# Altium project CaribouLite.PrjPcb (part 1 of 2)
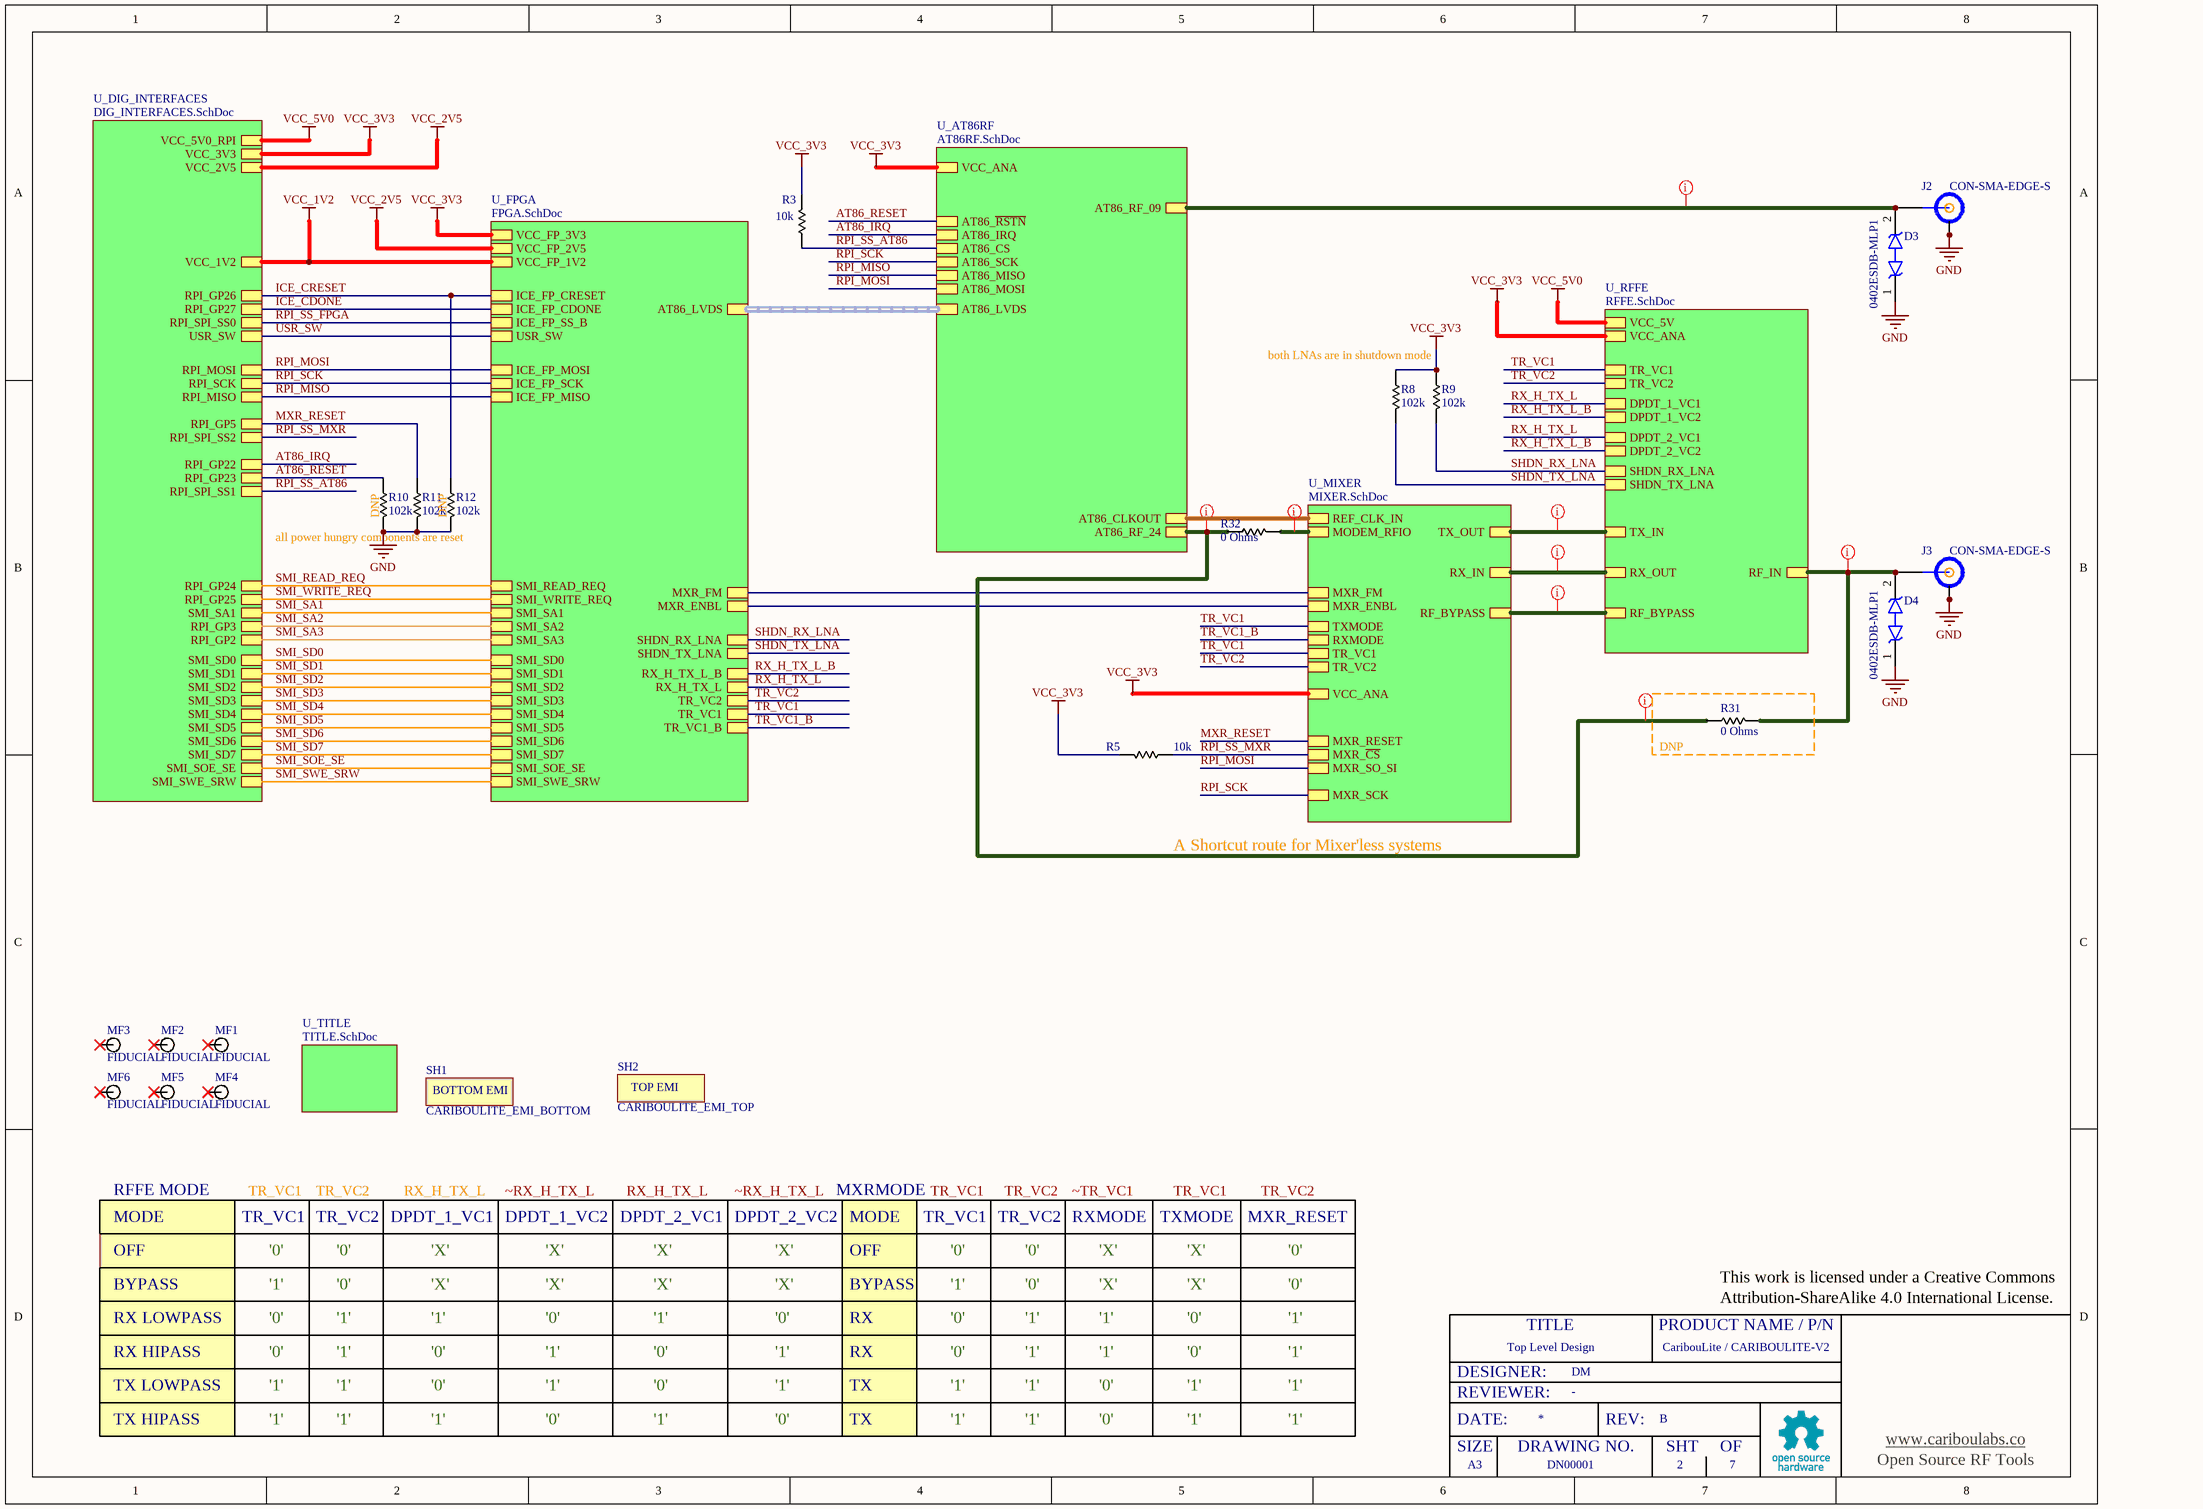
[diagram p0: Top.SchDoc]
DrawingNumber: DN00001; PCB_Designer: DM; PCB_DrawingNum: DN00002; PCB_Rev: R2.8; PCB_Reviewer: -; ProductNamePN: CaribouLite / CARIBOULITE-V2
7 sheets, 271 parts. Net scope: hierarchical (ports join the sheet entries above them; power ports are global).
Sheets:
  Top.SchDoc
    U_AT86RF = AT86RF.SchDoc
    U_FPGA = FPGA.SchDoc
    U_RFFE = RFFE.SchDoc
    U_DIG_INTERFACES = DIG_INTERFACES.SchDoc
    U_MIXER = MIXER.SchDoc
    U_TITLE = TITLE.SchDoc

## Sheet Top.SchDoc
size A3; DocumentNumber: 2; Revision: B; SheetNumber: 2; SheetTotal: 7; SheetTitle: Top Level Design; Designer: DM; Reviewer: -; PageSetup: Record=PageOptions|CenterHorizontal=True|CenterVertical=True|PrintScale=1.04|XCorrection=1.00|YCorrection=1.00|PrintKind=0|BorderSize=5000000|LeftOffset=0|BottomOffset=0|Orientation=2|PaperLength=1000|PaperWidth=1000|Scale=100|PaperSource=7|PrintQuality=-3|MediaType=1|DitherType=10|PrintScaleMode=1|PaperKind=A3 297 x 420 mm|PaperIndex=8

### Parts
D3  0402ESDB-MLP1  [DIONC1105X44N]
D4  0402ESDB-MLP1  [DIONC1105X44N]
J2  CON-SMA-EDGE-S  [MOLEX_0732511150]
J3  CON-SMA-EDGE-S  [MOLEX_0732511150]
MF1  FIDUCIAL  [FIDUCIAL_1_0_MM]  (net tie, no BOM)
MF2  FIDUCIAL  [FIDUCIAL_1_0_MM]  (net tie, no BOM)
MF3  FIDUCIAL  [FIDUCIAL_1_0_MM]  (net tie, no BOM)
MF4  FIDUCIAL  [FIDUCIAL_1_0_MM]  (net tie, no BOM)
MF5  FIDUCIAL  [FIDUCIAL_1_0_MM]  (net tie, no BOM)
MF6  FIDUCIAL  [FIDUCIAL_1_0_MM]  (net tie, no BOM)
R3  10k  [PANASONIC 0402]
R5  10k  [PANASONIC 0402]
R8  102k  [PANASONIC 0402]
R9  102k  [PANASONIC 0402]
R10  102k  [PANASONIC 0402]
R11  102k  [PANASONIC 0402]
R12  102k  [PANASONIC 0402]
R31  0 Ohms  [PANASONIC 0402]
R32  0 Ohms  [PANASONIC 0402]
SH1  CARIBOULITE_EMI_BOTTOM  [CARIBOULITE_EMI_BOTTOM]  (no BOM)
SH2  CARIBOULITE_EMI_TOP  [CARIBOULITE_EMI_TOP]  (no BOM)

### Blocks framed on the sheet
DNP: R31

### Sub-sheets
U_AT86RF = AT86RF.SchDoc: AT86_CLKOUT, AT86_RF_24, AT86_RF_09, AT86_~{RSTN}, AT86_IRQ, AT86_CS, AT86_SCK, AT86_MISO, AT86_MOSI, VCC_ANA, AT86_LVDS (harness AT86_LVDS)
U_DIG_INTERFACES = DIG_INTERFACES.SchDoc: VCC_2V5, VCC_1V2, VCC_5V0_RPI, RPI_SPI_SS2, RPI_MOSI, RPI_SCK, RPI_MISO, RPI_GP27, RPI_SPI_SS0, RPI_SPI_SS1, RPI_GP22, VCC_3V3, RPI_GP23, USR_SW, SMI_SD5, SMI_SOE_SE, SMI_SD3, SMI_SD1, SMI_SD2, SMI_SA1, SMI_SD4, SMI_SWE_SRW, SMI_SD0, SMI_SD6, SMI_SD7, RPI_GP2, RPI_GP3, RPI_GP26, RPI_GP25, RPI_GP5, RPI_GP24
U_FPGA = FPGA.SchDoc: VCC_FP_1V2, VCC_FP_3V3, AT86_LVDS (harness AT86_LVDS), ICE_FP_CRESET, ICE_FP_CDONE, ICE_FP_SS_B, ICE_FP_MOSI, ICE_FP_SCK, ICE_FP_MISO, TR_VC1, RX_H_TX_L, TR_VC2, TR_VC1_B, RX_H_TX_L_B, SHDN_TX_LNA, SHDN_RX_LNA, USR_SW, MXR_FM, MXR_ENBL, SMI_SD5, SMI_SOE_SE, SMI_WRITE_REQ, SMI_SD3, SMI_SD1, SMI_SD2, SMI_SA1, SMI_SD4, SMI_SWE_SRW, SMI_SD0, SMI_SD6, SMI_SD7, SMI_SA2, SMI_SA3, VCC_FP_2V5, SMI_READ_REQ
U_MIXER = MIXER.SchDoc: VCC_ANA, MXR_~{CS}, MXR_SO_SI, MXR_SCK, REF_CLK_IN, MXR_RESET, TX_OUT, RX_IN, MODEM_RFIO, RXMODE, TXMODE, RF_BYPASS, TR_VC2, TR_VC1, MXR_FM, MXR_ENBL
U_RFFE = RFFE.SchDoc: VCC_ANA, RF_IN, TX_IN, RX_OUT, TR_VC1, TR_VC2, DPDT_1_VC1, DPDT_1_VC2, DPDT_2_VC1, DPDT_2_VC2, RF_BYPASS, SHDN_TX_LNA, SHDN_RX_LNA, VCC_5V
U_TITLE = TITLE.SchDoc: no entries

### Nets
GND: D3.1 D4.1 J2.2(OUTER) J2.3(OUTER) J2.4(OUTER) J2.5(OUTER) J2.6(OUTER) J2.7(OUTER) J3.2(OUTER) J3.3(OUTER) J3.4(OUTER) J3.5(OUTER) J3.6(OUTER) J3.7(OUTER) R10.2 R11.2 R12.2
VCC_1V2: sheet U_FPGA/VCC_FP_1V2, sheet U_DIG_INTERFACES/VCC_1V2
VCC_2V5: sheet U_FPGA/VCC_FP_2V5, sheet U_DIG_INTERFACES/VCC_2V5
VCC_3V3: R3.2 R5.2 R8.1 R9.1 ; sheet U_AT86RF/VCC_ANA, sheet U_FPGA/VCC_FP_3V3, sheet U_RFFE/VCC_ANA, sheet U_DIG_INTERFACES/VCC_3V3, sheet U_MIXER/VCC_ANA  [project net RFFE_LNA_VCC]
VCC_5V0: sheet U_RFFE/VCC_5V, sheet U_DIG_INTERFACES/VCC_5V0_RPI  [project net RFFE_5V]
AT86_IRQ: sheet U_AT86RF/AT86_IRQ, sheet U_DIG_INTERFACES/RPI_GP22
AT86_RESET: R10.1 ; sheet U_AT86RF/AT86_~{RSTN}, sheet U_DIG_INTERFACES/RPI_GP23
ICE_CDONE: sheet U_FPGA/ICE_FP_CDONE, sheet U_DIG_INTERFACES/RPI_GP27
ICE_CRESET: R12.1 ; sheet U_FPGA/ICE_FP_CRESET, sheet U_DIG_INTERFACES/RPI_GP26
MXR_ENBL: sheet U_FPGA/MXR_ENBL, sheet U_MIXER/MXR_ENBL
MXR_FM: sheet U_FPGA/MXR_FM, sheet U_MIXER/MXR_FM
MXR_RESET: R11.1 ; sheet U_DIG_INTERFACES/RPI_GP5, sheet U_MIXER/MXR_RESET  [project net GP5_SA0]
RPI_MISO: sheet U_AT86RF/AT86_MISO, sheet U_FPGA/ICE_FP_MISO, sheet U_DIG_INTERFACES/RPI_MISO
RPI_MOSI: sheet U_AT86RF/AT86_MOSI, sheet U_FPGA/ICE_FP_MOSI, sheet U_DIG_INTERFACES/RPI_MOSI, sheet U_MIXER/MXR_SO_SI
RPI_SCK: sheet U_AT86RF/AT86_SCK, sheet U_FPGA/ICE_FP_SCK, sheet U_DIG_INTERFACES/RPI_SCK, sheet U_MIXER/MXR_SCK  [project net ICE_FP_SCK]
RPI_SS_AT86: R3.1 ; sheet U_AT86RF/AT86_CS, sheet U_DIG_INTERFACES/RPI_SPI_SS1
RPI_SS_FPGA: sheet U_FPGA/ICE_FP_SS_B, sheet U_DIG_INTERFACES/RPI_SPI_SS0  [project net ICE_FP_SS_B]
RPI_SS_MXR: R5.1 ; sheet U_DIG_INTERFACES/RPI_SPI_SS2, sheet U_MIXER/MXR_~{CS}
RX_H_TX_L: sheet U_FPGA/RX_H_TX_L, sheet U_RFFE/DPDT_1_VC1, sheet U_RFFE/DPDT_2_VC1  [project net DPDT_1_VC1]
RX_H_TX_L_B: sheet U_FPGA/RX_H_TX_L_B, sheet U_RFFE/DPDT_1_VC2, sheet U_RFFE/DPDT_2_VC2  [project net DPDT_1_VC2]
SHDN_RX_LNA: R9.2 ; sheet U_FPGA/SHDN_RX_LNA, sheet U_RFFE/SHDN_RX_LNA
SHDN_TX_LNA: R8.2 ; sheet U_FPGA/SHDN_TX_LNA, sheet U_RFFE/SHDN_TX_LNA
SMI_READ_REQ: sheet U_FPGA/SMI_READ_REQ, sheet U_DIG_INTERFACES/RPI_GP24
SMI_SA1: sheet U_FPGA/SMI_SA1, sheet U_DIG_INTERFACES/SMI_SA1  [project net GP4_SA1]
SMI_SA2: sheet U_FPGA/SMI_SA2, sheet U_DIG_INTERFACES/RPI_GP3
SMI_SA3: sheet U_FPGA/SMI_SA3, sheet U_DIG_INTERFACES/RPI_GP2
SMI_SD0: sheet U_FPGA/SMI_SD0, sheet U_DIG_INTERFACES/SMI_SD0  [project net GP8_SD0]
SMI_SD1: sheet U_FPGA/SMI_SD1, sheet U_DIG_INTERFACES/SMI_SD1  [project net GP9_SD1]
SMI_SD2: sheet U_FPGA/SMI_SD2, sheet U_DIG_INTERFACES/SMI_SD2  [project net GP10_SD2]
SMI_SD3: sheet U_FPGA/SMI_SD3, sheet U_DIG_INTERFACES/SMI_SD3  [project net GP11_SD3]
SMI_SD4: sheet U_FPGA/SMI_SD4, sheet U_DIG_INTERFACES/SMI_SD4  [project net GP12_SD4]
SMI_SD5: sheet U_FPGA/SMI_SD5, sheet U_DIG_INTERFACES/SMI_SD5  [project net GP13_SD5]
SMI_SD6: sheet U_FPGA/SMI_SD6, sheet U_DIG_INTERFACES/SMI_SD6  [project net GP14_SD6]
SMI_SD7: sheet U_FPGA/SMI_SD7, sheet U_DIG_INTERFACES/SMI_SD7  [project net GP15_SD7]
SMI_SOE_SE: sheet U_FPGA/SMI_SOE_SE, sheet U_DIG_INTERFACES/SMI_SOE_SE  [project net GP6_SOE_SE]
SMI_SWE_SRW: sheet U_FPGA/SMI_SWE_SRW, sheet U_DIG_INTERFACES/SMI_SWE_SRW  [project net GP7_SWE_SRW]
SMI_WRITE_REQ: sheet U_FPGA/SMI_WRITE_REQ, sheet U_DIG_INTERFACES/RPI_GP25
TR_VC1: sheet U_FPGA/TR_VC1, sheet U_RFFE/TR_VC1, sheet U_MIXER/TXMODE, sheet U_MIXER/TR_VC1  [project net RF_TR_VC1]
TR_VC1_B: sheet U_FPGA/TR_VC1_B, sheet U_MIXER/RXMODE  [project net RXMODE]
TR_VC2: sheet U_FPGA/TR_VC2, sheet U_RFFE/TR_VC2, sheet U_MIXER/TR_VC2  [project net RF_TR_VC2]
USR_SW: sheet U_FPGA/USR_SW, sheet U_DIG_INTERFACES/USR_SW
NetC11_2: sheet U_AT86RF/AT86_CLKOUT, sheet U_MIXER/REF_CLK_IN
NetC19_1: R31.1 R32.1 ; sheet U_AT86RF/AT86_RF_24
NetC22_1: D3.2 J2.1(INNER) ; sheet U_AT86RF/AT86_RF_09
NetC47_2: D4.2 J3.1(INNER) R31.2 ; sheet U_RFFE/RF_IN
NetC48_2: sheet U_RFFE/TX_IN, sheet U_MIXER/TX_OUT
NetC50_2: sheet U_RFFE/RX_OUT, sheet U_MIXER/RX_IN
NetC84_2: sheet U_RFFE/RF_BYPASS, sheet U_MIXER/RF_BYPASS
NetR32_2: R32.2 ; sheet U_MIXER/MODEM_RFIO

Not connected (* = marked no-connect by the designer): MF1 1; MF2 1; MF3 1; MF4 1; MF5 1; MF6 1

### Buses and harness runs
harness sheet U_AT86RF/AT86_LVDS = sheet U_FPGA/AT86_LVDS

### Layout directives
net class RF50OHM: NetC19_1, NetC22_1, NetC47_2, NetC48_2, NetC50_2, NetC84_2, NetR32_2

### Notes on the sheet
- both LNAs are in shutdown mode
- (near R10) DNP
- (near R12) DNP
- all power hungry components are reset
- A Shortcut route for Mixer'less systems
- MODE
- OFF
- RFFE MODE
- TR_VC1
- '0'
- TR_VC2
- DPDT_1_VC1
- RX_H_TX_L
- 'X'
- DPDT_1_VC2
- ~RX_H_TX_L
- DPDT_2_VC1
- DPDT_2_VC2
- MXRMODE
- RXMODE
- ~TR_VC1
- TXMODE
- MXR_RESET
- BYPASS
- RX LOWPASS
- '1'
- RX
- This work is licensed under a Creative Commons
- Attribution-ShareAlike 4.0 International License.
- RX HIPASS
- TX LOWPASS
- TX
- TX HIPASS
- DESIGNER:
- REVIEWER:
- TITLE
- PRODUCT NAME / P/N
- SIZE
- DATE:
- DRAWING NO.
- REV:
- SHT
- OF
- www.cariboulabs.co
- A3
- Open Source RF Tools
- (in symbol CARIBOULITE_EMI_BOTTOM) BOTTOM EMI
- (in symbol CARIBOULITE_EMI_TOP) TOP EMI

### Library data of the parts
D3 D4 = LXES15AAA1-153: ESD Suppressors / TVS Diodes ESD Protection Device, 0402, Bidirectional, 4V working, 15V breakdown, 0.05pF Cd; Manu. P/N: 0402ESDB-MLP1
J2 J3 = CON-SMA-EDGE-S: RF SMA Connectors / Coaxial Connectors SMA Female PCB Edge Mount; Manu. P/N: CON-SMA-EDGE-S
R3 R5 = Resistor: Thick Film Resistors - SMD 0402 1/16watt 10Kohms 1%; Manu. P/N: CRCW040210K0FKEDC; Power Rating: 62.5 mW (1/16 W); Temp. Ceoff.: 100 PPM/C; Tolerance: 1%; VALUE: 10k
R8-R12 = Resistor: Thick Film Resistors - SMD 102 kOhms 62.5mW 0402 1%; Manu. P/N: RC0402FR-07102KL; Power Rating: 62.5 mW (1/16 W); Temp. Ceoff.: 100 PPM / C; Tolerance: 1%; VALUE: 102k
R31 R32 = Resistor: 0 Ohms jumper resistor 0402; Manu. P/N: CRCW04020000Z0EDC; Power Rating: 62.5 mW (1/16 W); Temp. Ceoff.: 0 PPM/C; Tolerance: 1%; VALUE: 0 Ohms
MF1-MF6 = FIDUCIAL: MANU_PN: FIDUCIAL

## Sheet AT86RF.SchDoc
size A3; DocumentNumber: 7; Revision: B; SheetNumber: 7; SheetTotal: 7; SheetTitle: Modem and TCXO; Designer: DM; Reviewer: -
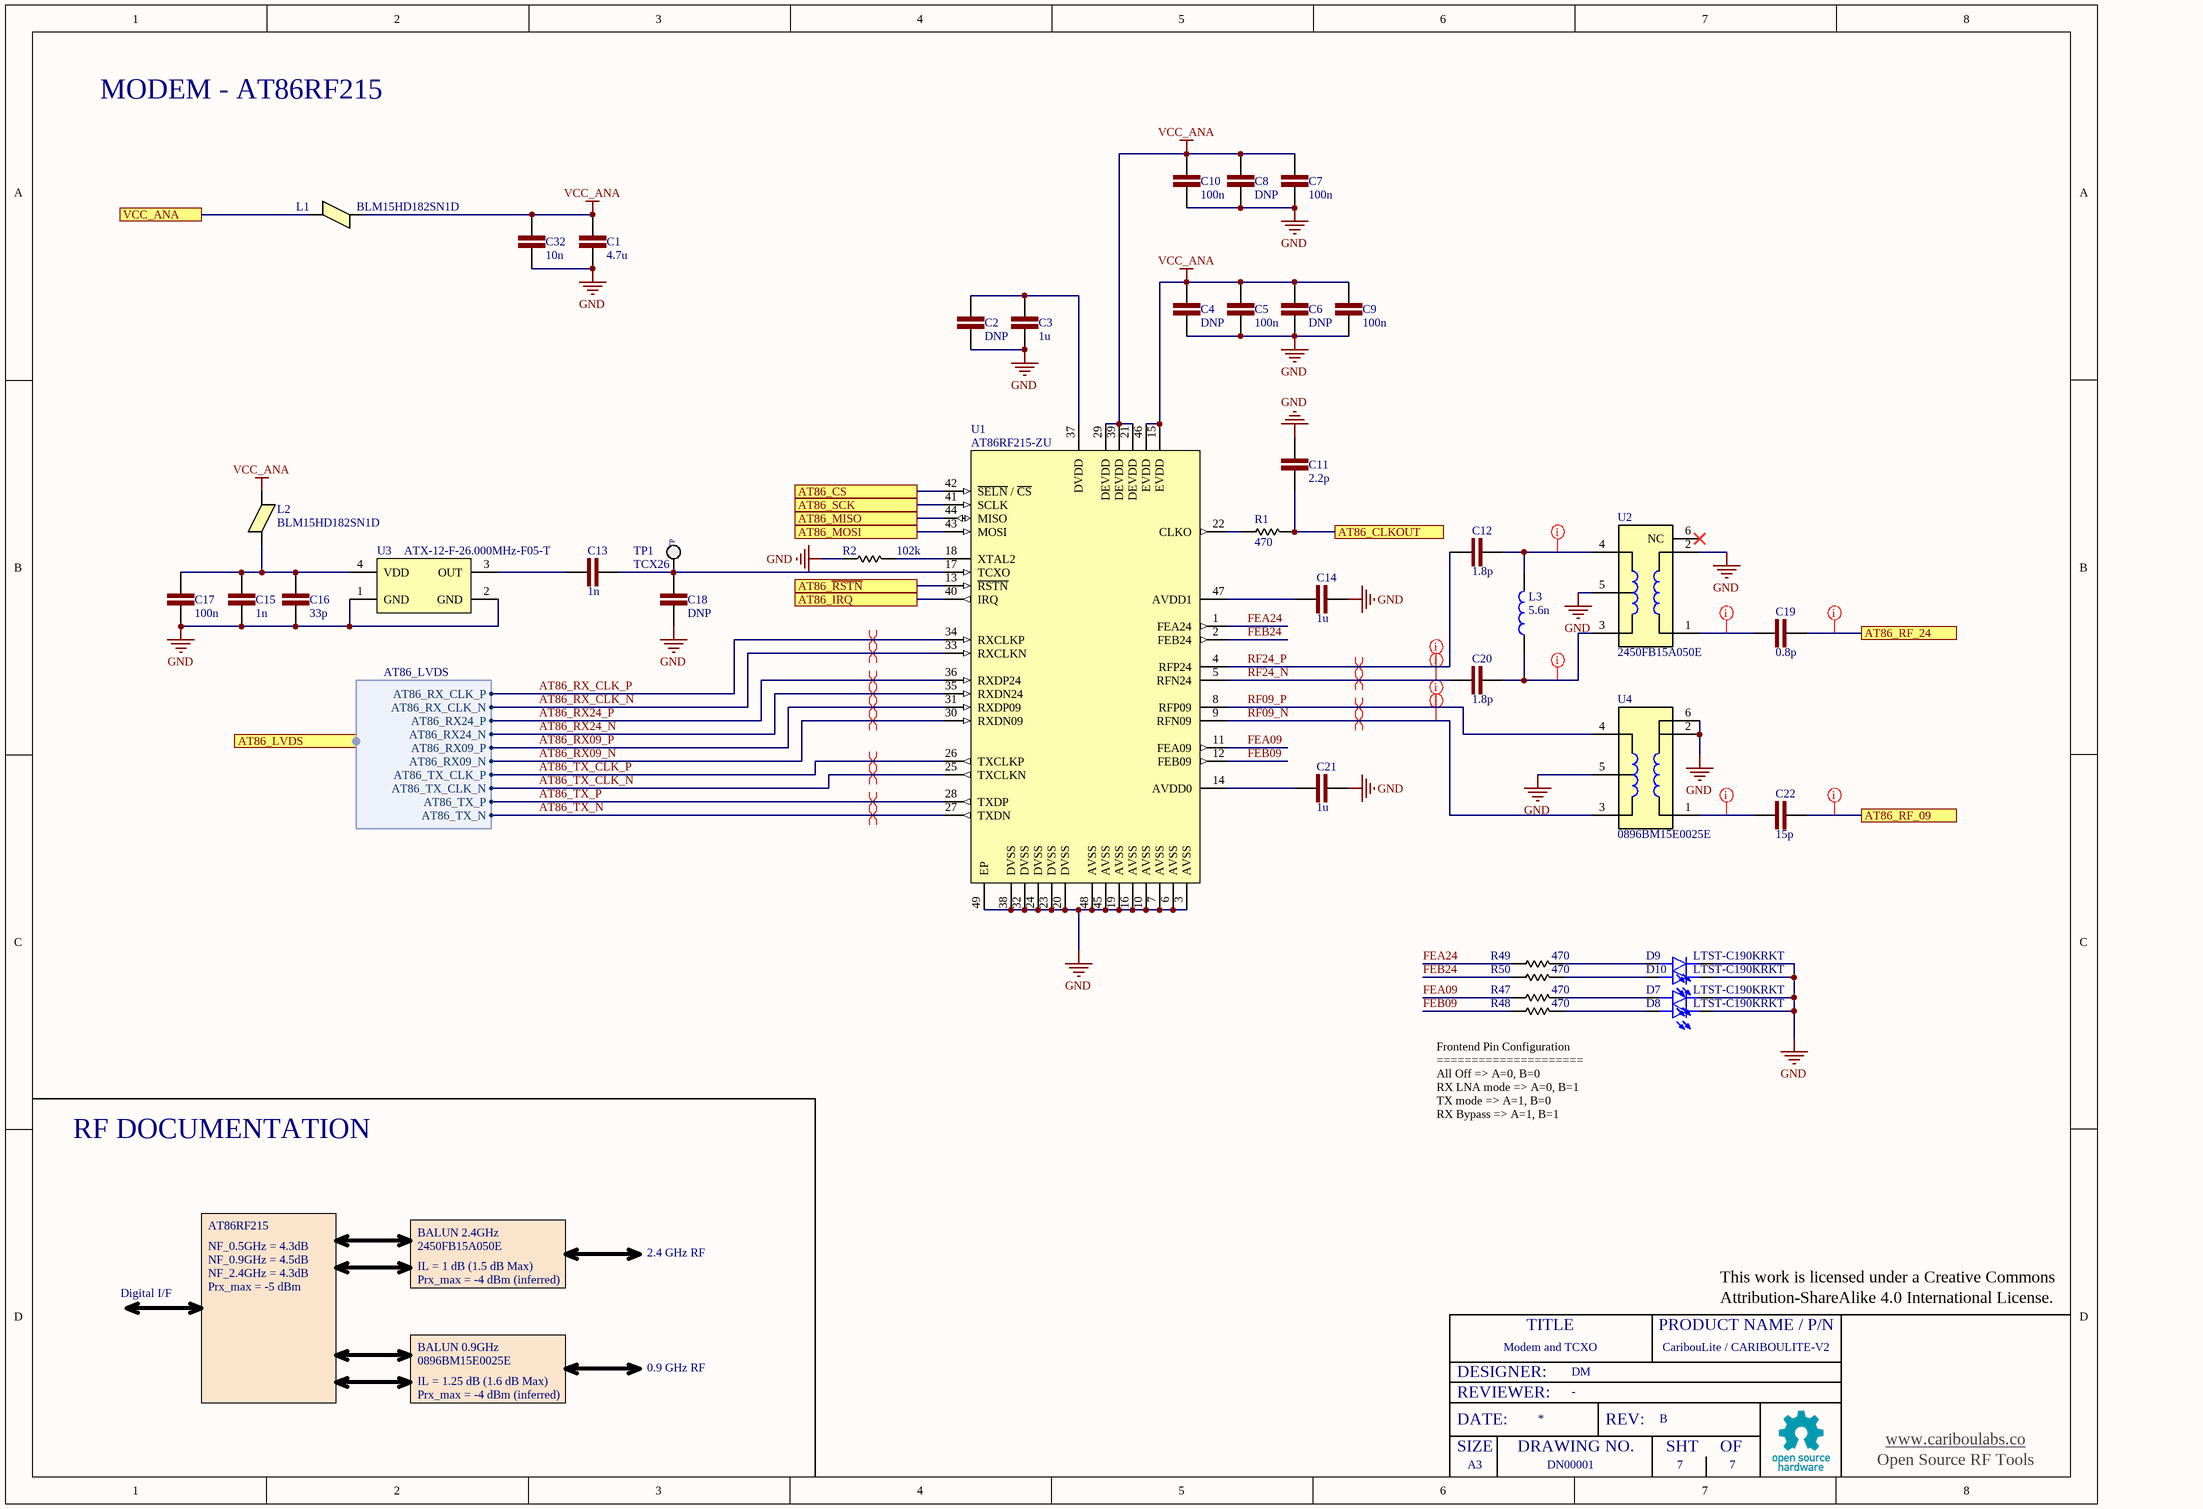
[diagram p1: AT86RF.SchDoc]

### Parts
C1  4.7u  [MURATA 0402]
C2  DNP  [MURATA 0402]
C3  1u  [MURATA 0402]
C4  DNP  [MURATA 0402]
C5  100n  [MURATA 0402]
C6  DNP  [MURATA 0402]
C7  100n  [MURATA 0402]
C8  DNP  [MURATA 0402]
C9  100n  [MURATA 0402]
C10  100n  [MURATA 0402]
C11  2.2p  [MURATA 0402]
C12  1.8p  [MURATA 0402]
C13  1n  [MURATA 0402]
C14  1u  [MURATA 0402]
C15  1n  [MURATA 0402]
C16  33p  [MURATA 0402]
C17  100n  [MURATA 0402]
C18  DNP  [MURATA 0402]
C19  0.8p  [MURATA 0402]
C20  1.8p  [MURATA 0402]
C21  1u  [MURATA 0402]
C22  15p  [MURATA 0402]
C32  10n  [MURATA 0402]
D7  LTST-C190KRKT  [LEDC1608X35N]
D8  LTST-C190KRKT  [LEDC1608X35N]
D9  LTST-C190KRKT  [LEDC1608X35N]
D10  LTST-C190KRKT  [LEDC1608X35N]
L1  BLM15HD182SN1D  [0402 FERRITE BEAD]
L2  BLM15HD182SN1D  [0402 FERRITE BEAD]
L3  5.6n  [CoilCraft 0402]
R1  470  [PANASONIC 0402]
R2  102k  [PANASONIC 0402]
R47  470  [PANASONIC 0402]
R48  470  [PANASONIC 0402]
R49  470  [PANASONIC 0402]
R50  470  [PANASONIC 0402]
TP1  TCX26  [TP_40]
U1  AT86RF215-ZU  [QFN50P700X700X90-49N-D]
U2  2450FB15A050E  [FIL_0896BM15E0025E]
U3  ATX-12-F-26.000MHz-F05-T  [TCXO_4_25x20]
U4  0896BM15E0025E  [FIL_0896BM15E0025E]

### Ports
AT86_CLKOUT, AT86_CS, AT86_IRQ, AT86_LVDS (harness AT86_LVDS), AT86_MISO, AT86_MOSI, AT86_RF_09, AT86_RF_24, AT86_SCK, AT86_~{RSTN}, VCC_ANA

### Harnesses
AT86_LVDS: AT86_RX_CLK_P, AT86_RX_CLK_N, AT86_RX24_P, AT86_RX24_N, AT86_RX09_P, AT86_RX09_N, AT86_TX_CLK_P, AT86_TX_CLK_N, AT86_TX_P, AT86_TX_N

### Nets
GND: C1.2 C2.1 C3.2 C4.1 C5.1 C6.1 C7.1 C8.1 C9.1 C10.1 C11.1 C14.1 C15.1 C16.1 C17.1 C18.1 C21.1 C32.2 D7.C D8.C D9.C D10.C R2.1 U1.3(AVSS) U1.6(AVSS) U1.7(AVSS) U1.10(AVSS) U1.16(AVSS) U1.19(AVSS) U1.20(DVSS) U1.23(DVSS) U1.24(DVSS) U1.32(DVSS) U1.38(DVSS) U1.45(AVSS) U1.48(AVSS) U1.49(EP) U2.2(GND) U2.5(GND) U3.1(GND) U3.2(GND) U4.2(GND) U4.5(GND) U4.6(GND)
RFFE_LNA_VCC: L1.1 ; port VCC_ANA
VCC_ANA: C1.1 C4.2 C5.2 C6.2 C7.2 C8.2 C9.2 C10.2 C32.1 L1.2 L2.2 U1.15(EVDD) U1.21(DEVDD) U1.29(DEVDD) U1.39(DEVDD) U1.46(EVDD)
AT86_IRQ: U1.40(IRQ) ; port AT86_IRQ
AT86_RESET: U1.13(~{RSTN}) ; port AT86_~{RSTN}
AT86_RX09_N: U1.30(RXDN09) ; port AT86_LVDS.AT86_RX09_N
AT86_RX09_P: U1.31(RXDP09) ; port AT86_LVDS.AT86_RX09_P
AT86_RX24_N: U1.35(RXDN24) ; port AT86_LVDS.AT86_RX24_N
AT86_RX24_P: U1.36(RXDP24) ; port AT86_LVDS.AT86_RX24_P
AT86_RX_CLK_N: U1.33(RXCLKN) ; port AT86_LVDS.AT86_RX_CLK_N
AT86_RX_CLK_P: U1.34(RXCLKP) ; port AT86_LVDS.AT86_RX_CLK_P
AT86_TX_CLK_N: U1.25(TXCLKN) ; port AT86_LVDS.AT86_TX_CLK_N
AT86_TX_CLK_P: U1.26(TXCLKP) ; port AT86_LVDS.AT86_TX_CLK_P
AT86_TX_N: U1.27(TXDN) ; port AT86_LVDS.AT86_TX_N
AT86_TX_P: U1.28(TXDP) ; port AT86_LVDS.AT86_TX_P
FEA09: R47.1 U1.11(FEA09)
FEA24: R49.1 U1.1(FEA24)
FEB09: R48.1 U1.12(FEB09)
FEB24: R50.1 U1.2(FEB24)
ICE_FP_SCK: U1.41(SCLK) ; port AT86_SCK
RF09_N: U1.9(RFN09) U4.3(B1)
RF09_P: U1.8(RFP09) U4.4(B2)
RF24_N: C20.2 U1.5(RFN24)
RF24_P: C12.2 U1.4(RFP24)
RPI_MISO: U1.44(MISO) ; port AT86_MISO
RPI_MOSI: U1.43(MOSI) ; port AT86_MOSI
RPI_SS_AT86: U1.42(~{SELN}_/_~{CS}) ; port AT86_CS
NetC2_2: C2.2 C3.1 U1.37(DVDD)
NetC11_2: C11.2 R1.2 ; port AT86_CLKOUT
NetC12_1: C12.1 L3.2 U2.4(B2)
NetC13_1: C13.1 C18.2 TP1.1(TP) U1.17(TCXO)
NetC13_2: C13.2 U3.3(OUT)
NetC14_2: C14.2 U1.47(AVDD1)
NetC15_2: C15.2 C16.2 C17.2 L2.1 U3.4(VDD)
NetC19_1: C19.1 ; port AT86_RF_24
NetC19_2: C19.2 U2.1(UB)
NetC20_1: C20.1 L3.1 U2.3(B1)
NetC21_2: C21.2 U1.14(AVDD0)
NetC22_1: C22.1 ; port AT86_RF_09
NetC22_2: C22.2 U4.1(UB)
NetD7_A: D7.A R47.2
NetD8_A: D8.A R48.2
NetD9_A: D9.A R49.2
NetD10_A: D10.A R50.2
NetR1_1: R1.1 U1.22(CLKO)
NetR2_2: R2.2 U1.18(XTAL2)

Not connected (* = marked no-connect by the designer): U2 6(NC)*

### Layout directives
differential pair: AT86_RX09_N, AT86_RX09_P, AT86_RX24_N, AT86_RX24_P, AT86_RX_CLK_N, AT86_RX_CLK_P, AT86_TX_CLK_N, AT86_TX_CLK_P, AT86_TX_N, AT86_TX_P, RF09_N, RF09_P, RF24_N, RF24_P
net class RF50OHM: NetC12_1, NetC19_1, NetC19_2, NetC20_1, NetC22_1, NetC22_2, RF09_N, RF09_P, RF24_N, RF24_P

### Notes on the sheet
- MODEM - AT86RF215
- Frontend Pin Configuration
  =====================
  All Off => A=0, B=0
  RX LNA mode => A=0, B=1
  TX mode => A=1, B=0
  RX Bypass => A=1, B=1
- RF DOCUMENTATION
- AT86RF215
- NF_0.5GHz = 4.3dB
- NF_0.9GHz = 4.5dB
- BALUN 2.4GHz
- 2450FB15A050E
- 2.4 GHz RF
- Digital I/F
- NF_2.4GHz = 4.3dB
- Prx_max = -5 dBm
- IL = 1 dB (1.5 dB Max)
- Prx_max = -4 dBm (inferred)
- This work is licensed under a Creative Commons
- Attribution-ShareAlike 4.0 International License.
- BALUN 0.9GHz
- 0896BM15E0025E
- IL = 1.25 dB (1.6 dB Max)
- 0.9 GHz RF
- DESIGNER:
- REVIEWER:
- TITLE
- PRODUCT NAME / P/N
- SIZE
- DATE:
- DRAWING NO.
- REV:
- SHT
- OF
- www.cariboulabs.co
- A3
- Open Source RF Tools

### Library data of the parts
C1 = Capacitor: Multilayer Ceramic Capacitors MLCC - SMD/SMT 0402 MLCC X5R 4.7 uF +/ -20% 10V; Tolerance: 20%; Manu. P/N: GRJ155R61A475ME11J; Temp. Range: [-55, 85]; SRF: TBD [GHz]; Initial Voltage: 0; Vmax: 10V; Technology: X5R; VALUE: 4.7u
C2 = Capacitor: Tolerance: 5%; Vmax: 10V; Temp. Range: [-40, 125]; SRF: TBD [GHz]; Initial Voltage: 0; Manu. P/N: DNP; Technology: C0G; VALUE: DNP
C3 = Capacitor: Multilayer Ceramic Capacitors MLCC - SMD/SMT 0402 10VDC 1uF 20% X5R; Vmax: 10V; Manu. P/N: LMK105BJ105MVHF; Temp. Range: [-55, 85]; SRF: TBD [GHz]; Initial Voltage: 0; Tolerance: 20%; Technology: X5R; VALUE: 1u
C4 C6 C8 C18 = Capacitor: Capacitor - dc block; Tolerance: 5%; Vmax: 10V; Temp. Range: [-40, 125]; SRF: TBD [GHz]; Initial Voltage: 0; Manu. P/N: DNP; Technology: C0G; VALUE: DNP
C5 C7 C9 C10 C17 = Capacitor: Multilayer Ceramic Capacitors MLCC - SMD/SMT 16V .1uF X5R 0402 10%; Manu. P/N: 0402YD104KAT2A; Temp. Range: [-55, 85]; SRF: TBD [GHz]; Initial Voltage: 0; Tolerance: 10%; Vmax: 16V; Technology: X5R; VALUE: 100n
C11 = Capacitor: Multilayer Ceramic Capacitors MLCC - SMD/SMT, 0402 2.2pF +-0.1% 50V; Tolerance: 0.1%; Manu. P/N: 0402N2R2B500CT; Temp. Range: [-55, 125]; SRF: TBD [GHz]; Initial Voltage: 0; Vmax: 50V; Technology: C0G; VALUE: 2.2p
C12 C20 = Capacitor: Multilayer Ceramic Capacitors MLCC - SMD/SMT, 0402 1.8pF +-0.1% 50V; Tolerance: 5%; Manu. P/N: 0402N1R8B500CT; Temp. Range: [-55, 125]; SRF: TBD [GHz]; Initial Voltage: 0; Vmax: 50V; Technology: C0G; VALUE: 1.8p
C13 C15 = Capacitor: Multilayer Ceramic Capacitors MLCC 1000pF ±5% 100V C0G 0402; Manu. P/N: GRM1555C2A102JE01D; Temp. Range: [-40, 125]; SRF: TBD [GHz]; Initial Voltage: 0; Tolerance: 5%; Vmax: 100V; Technology: C0G; VALUE: 1n
C14 C21 = Capacitor: Multilayer Ceramic Capacitors MLCC - SMD/SMT 0402 10VDC 1uF 20% X5R; Tolerance: 5%; Vmax: 10V; Manu. P/N: LMK105BJ105MVHF; Temp. Range: [-55, 85]; SRF: TBD [GHz]; Initial Voltage: 0; Technology: X5R; VALUE: 1u
C16 = Capacitor: Multilayer Ceramic Capacitors MLCC - SMD/SMT 0402 50V 33pF C0G 0402 5%; Manu. P/N: C0402C330J5GAC; Temp. Range: [-55, 125]; SRF: TBD [GHz]; Initial Voltage: 0; Tolerance: 5%; Vmax: 50V; Technology: C0G; VALUE: 33p
C19 = Capacitor: Multilayer Ceramic Capacitors MLCC - SMD/SMT 0402 0pF 50volts C0G, 0.8pF; Alternative_MPN_Low_Price: 0402N0R8A500CT; Tolerance: 0.05pF; Vmax: 50V; Manu. P/N: GCM1555C1HR80WA16D; Temp. Range: [-55, 125]; SRF: TBD [GHz]; Initial Voltage: 0; Technology: C0G; VALUE: 0.8p
C22 = Capacitor: Multilayer Ceramic Capacitors MLCC - SMD/SMT 0402 15pF 50volts, C0G; Tolerance: 5%; Vmax: 50V; Manu. P/N: 0402N150J500CT; Temp. Range: [-55, 125]; SRF: TBD [GHz]; Initial Voltage: 0; Technology: C0G; VALUE: 15p
C32 = Capacitor: Multilayer Ceramic Capacitors MLCC - SMD/SMT 0402, 0.01UF 25V C0G; Tolerance: 5%; Manu. P/N: GRM1555C1E103JE01J; Temp. Range: [-55, 125]; SRF: TBD [GHz]; Initial Voltage: 0; Vmax: 25V; Technology: C0G; VALUE: 10n
D7-D10 = LTST-C190KRKT: Red 631nm LED Indication - Discrete 2V 0603; Manu. P/N: LTST-C190KRKT
L1 L2 = BLM15: Ferrite Beads 1800ohms GHz HiSpd; Imax: 0.2 A; Max DC Resistance: 2.2 Ohms; Temp. Range: [-40, 125]; Tolerance: 25%; Impedance @ 100 MHz: 1800 Ohms; Manu. P/N: BLM15HD182SN1D
L3 = Inductor: Fixed Inductors 1005 5.6nH Unshld 2% 760mA 83mOhms; Manu. P/N: 0402CS-5N6XGLW; SRF: TBD [GHz]; Tolerance: 2%; DC Imax: 760mA; DC Rmax: 83mOhms; VALUE: 5.6n
R1 R47-R50 = Resistor: Thick Film Resistors - SMD 1/16watt 470ohms 1%; Manu. P/N: CRCW0402470RFKED; Power Rating: 62.5 mW (1/16 W); Temp. Ceoff.: 100 PPM / C; Tolerance: 1%; VALUE: 470
R2 = Resistor: as R8 on sheet Top; Tolerance: 1%; VALUE: 102k
TP1 = TEST_POINT
U1 = AT86RF215-ZU: RF Transceiver Dual Band IEEE 802.15.4 TRX, 48QFN; Height: 0.9mm; Manu. P/N: AT86RF215-ZU
U2 = 2450FB15A050E: 2.45 GHz EIA 0805 Balun / Filter Combination 50 / 50Ohm 0805 (2012 Metric); Manu. P/N: 2450FB15A050E
U3 = ATX-12-F-26.000MHz-F05-T: TCXO Oscillators XTAL OSC TCXO 26 MHz Clipped Sinewave 0.5ppm -40C +85C 2.5x2mm, 1.6-3.6V; Value: 26 MHz; Manu. P/N: ATX-12-F-26.000MHz-F05-T
U4 = 0896BM15E0025E: RF Balun 863MHz ~ 928MHz 50 / 50Ohm 0805 (2012 Metric); Manu. P/N: 0896BM15E0025E

## Sheet FPGA.SchDoc
size A3; DocumentNumber: 4; Revision: B; SheetNumber: 4; SheetTotal: 7; SheetTitle: FPGA ICE40LP; Designer: DM; Reviewer: -
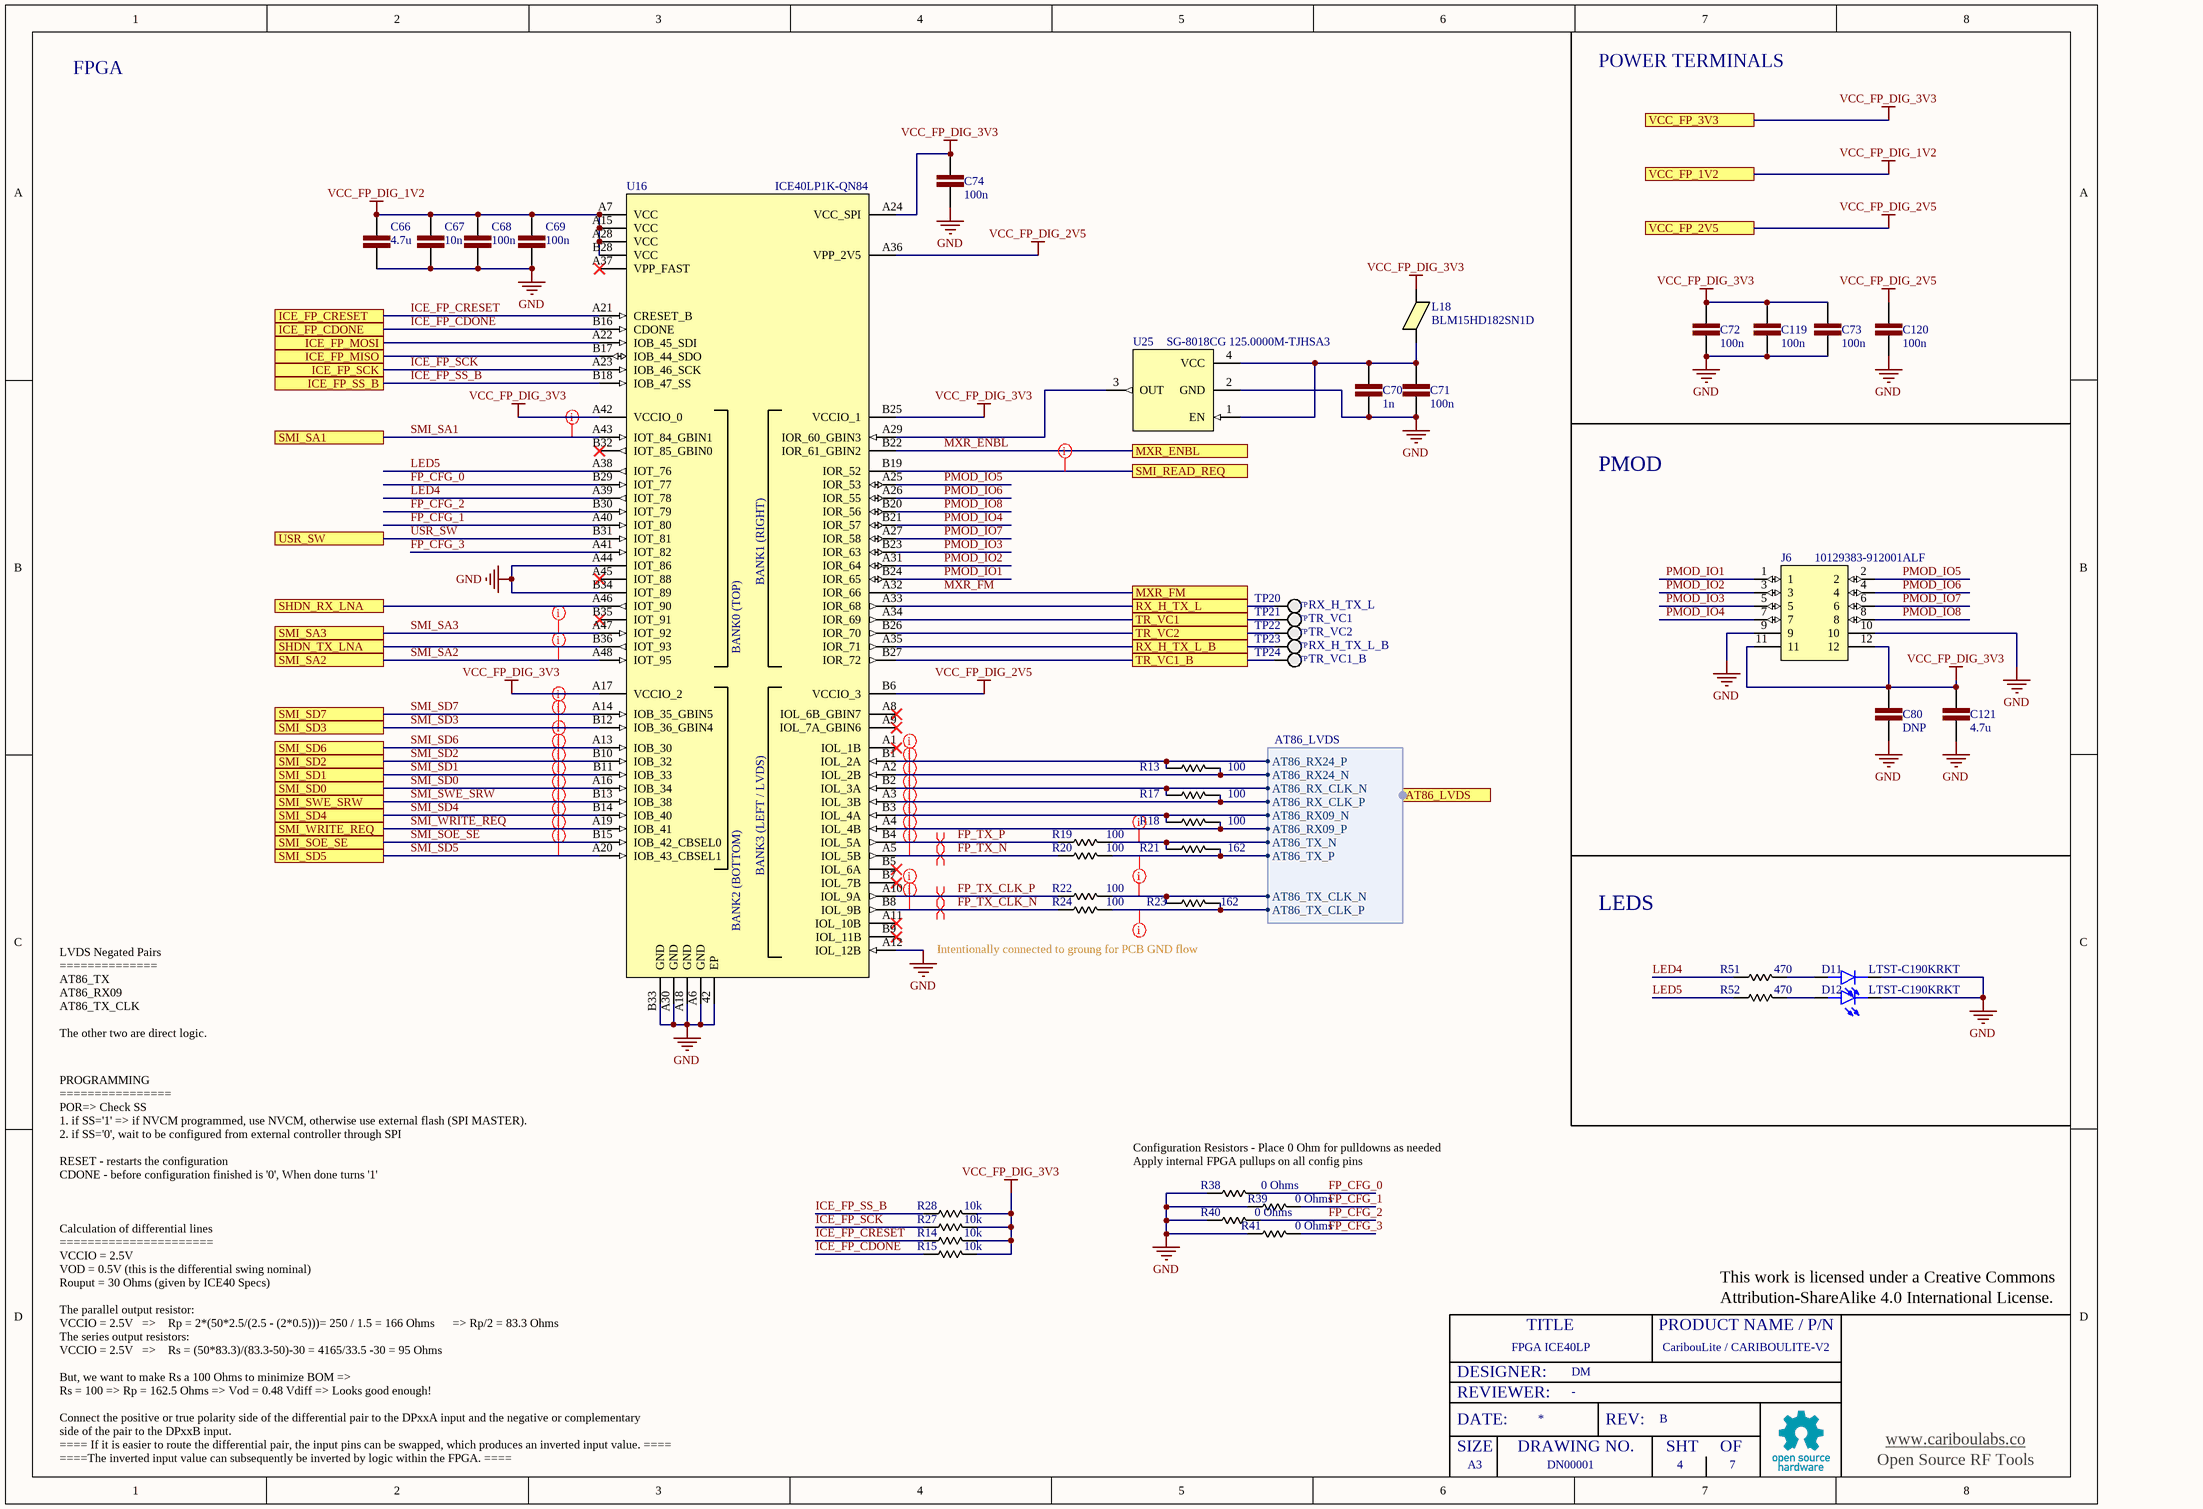
[diagram p2: FPGA.SchDoc]

### Parts
C66  4.7u  [MURATA 0402]
C67  10n  [MURATA 0402]
C68  100n  [MURATA 0402]
C69  100n  [MURATA 0402]
C70  1n  [MURATA 0402]
C71  100n  [MURATA 0402]
C72  100n  [MURATA 0402]
C73  100n  [MURATA 0402]
C74  100n  [MURATA 0402]
C80  DNP  [MURATA 0402]
C119  100n  [MURATA 0402]
C120  100n  [MURATA 0402]
C121  4.7u  [MURATA 0402]
D11  LTST-C190KRKT  [LEDC1608X35N]
D12  LTST-C190KRKT  [LEDC1608X35N]
J6  10129383-912001ALF  [10129383912001ALF]
L18  BLM15HD182SN1D  [0402 FERRITE BEAD]
R13  100  [PANASONIC 0402]
R14  10k  [PANASONIC 0402]
R15  10k  [PANASONIC 0402]
R17  100  [PANASONIC 0402]
R18  100  [PANASONIC 0402]
R19  100  [PANASONIC 0402]
R20  100  [PANASONIC 0402]
R21  162  [PANASONIC 0402]
R22  100  [PANASONIC 0402]
R23  162  [PANASONIC 0402]
R24  100  [PANASONIC 0402]
R27  10k  [PANASONIC 0402]
R28  10k  [PANASONIC 0402]
R38  0 Ohms  [PANASONIC 0402]
R39  0 Ohms  [PANASONIC 0402]
R40  0 Ohms  [PANASONIC 0402]
R41  0 Ohms  [PANASONIC 0402]
R51  470  [PANASONIC 0402]
R52  470  [PANASONIC 0402]
TP20  RX_H_TX_L  [TP_40]
TP21  TR_VC1  [TP_40]
TP22  TR_VC2  [TP_40]
TP23  RX_H_TX_L_B  [TP_40]
TP24  TR_VC1_B  [TP_40]
U16  ICE40LP1K-QN84  [LATTICE_ICE40LP1K-QN84]
U25  Manu. P/N: SG-8018CG 125.0000M-TJHSA3  [SG-8018CG]  (hidden comment: SG-8018CG 125.0000M-TJHPA3)

### Ports
AT86_LVDS (harness AT86_LVDS), ICE_FP_CDONE, ICE_FP_CRESET, ICE_FP_MISO, ICE_FP_MOSI, ICE_FP_SCK, ICE_FP_SS_B, MXR_ENBL, MXR_FM, RX_H_TX_L, RX_H_TX_L_B, SHDN_RX_LNA, SHDN_TX_LNA, SMI_READ_REQ, SMI_SA1, SMI_SA2, SMI_SA3, SMI_SD0, SMI_SD1, SMI_SD2, SMI_SD3, SMI_SD4, SMI_SD5, SMI_SD6, SMI_SD7, SMI_SOE_SE, SMI_SWE_SRW, SMI_WRITE_REQ, TR_VC1, TR_VC1_B, TR_VC2, USR_SW, VCC_FP_1V2, VCC_FP_2V5, VCC_FP_3V3

### Harnesses
AT86_LVDS: AT86_RX24_P, AT86_RX24_N, AT86_TX_P, AT86_TX_N, AT86_RX09_P, AT86_RX09_N, AT86_TX_CLK_N, AT86_TX_CLK_P, AT86_RX_CLK_P, AT86_RX_CLK_N

### Nets
GND: C66.2 C67.2 C68.1 C69.1 C70.1 C71.1 C72.2 C73.1 C74.1 C80.2 C119.2 C120.1 C121.2 D11.C D12.C J6.9 J6.10 R38.2 R39.2 R40.2 R41.2 U16.42(EP) U16.A6(GND) U16.A12(IOL_12B) U16.A18(GND) U16.A30(GND) U16.A44(IOT_86) U16.B33(GND) U16.B34(IOT_89) U25.2(GND)
VCC_FP_DIG_1V2: C66.1 C67.1 C68.2 C69.2 U16.A7(VCC) U16.A15(VCC) U16.A28(VCC) U16.B28(VCC) ; port VCC_FP_1V2  [project net VCC_1V2]
VCC_FP_DIG_2V5: C120.2 U16.A36(VPP_2V5) U16.B6(VCCIO_3) ; port VCC_FP_2V5  [project net VCC_2V5]
VCC_FP_DIG_3V3: C72.1 C73.2 C74.2 C80.1 C119.1 C121.1 J6.11 J6.12 L18.2 R14.2 R15.2 R27.2 R28.2 U16.A17(VCCIO_2) U16.A24(VCC_SPI) U16.A42(VCCIO_0) U16.B25(VCCIO_1) ; port VCC_FP_3V3  [project net RFFE_LNA_VCC]
AT86_RX09_N: R18.1 U16.B3(IOL_4A) ; port AT86_LVDS.AT86_RX09_N
AT86_RX09_P: R18.2 U16.A4(IOL_4B) ; port AT86_LVDS.AT86_RX09_P
AT86_RX24_N: R13.2 U16.A2(IOL_2B) ; port AT86_LVDS.AT86_RX24_N
AT86_RX24_P: R13.1 U16.B1(IOL_2A) ; port AT86_LVDS.AT86_RX24_P
AT86_RX_CLK_N: R17.1 U16.B2(IOL_3A) ; port AT86_LVDS.AT86_RX_CLK_N
AT86_RX_CLK_P: R17.2 U16.A3(IOL_3B) ; port AT86_LVDS.AT86_RX_CLK_P
AT86_TX_CLK_N: R22.2 R23.1 ; port AT86_LVDS.AT86_TX_CLK_N
AT86_TX_CLK_P: R23.2 R24.2 ; port AT86_LVDS.AT86_TX_CLK_P
AT86_TX_N: R19.2 R21.1 ; port AT86_LVDS.AT86_TX_N
AT86_TX_P: R20.2 R21.2 ; port AT86_LVDS.AT86_TX_P
DPDT_1_VC1: TP20.1(TP) U16.A33(IOR_68) ; port RX_H_TX_L
DPDT_1_VC2: TP23.1(TP) U16.A35(IOR_71) ; port RX_H_TX_L_B
FP_CFG_0: R38.1 U16.B29(IOT_77)
FP_CFG_1: R39.1 U16.A40(IOT_80)
FP_CFG_2: R40.1 U16.B30(IOT_79)
FP_CFG_3: R41.1 U16.A41(IOT_82)
FP_TX_CLK_N: R24.1 U16.B8(IOL_9B)
FP_TX_CLK_P: R22.1 U16.A10(IOL_9A)
FP_TX_N: R20.1 U16.A5(IOL_5B)
FP_TX_P: R19.1 U16.B4(IOL_5A)
ICE_FP_CDONE: R15.1 U16.B16(CDONE) ; port ICE_FP_CDONE  [project net ICE_CDONE]
ICE_FP_CRESET: R14.1 U16.A21(CRESET_B) ; port ICE_FP_CRESET  [project net ICE_CRESET]
ICE_FP_SCK: R27.1 U16.A23(IOB_46_SCK) ; port ICE_FP_SCK
ICE_FP_SS_B: R28.1 U16.B18(IOB_47_SS) ; port ICE_FP_SS_B
LED4: R51.1 U16.A39(IOT_78)
LED5: R52.1 U16.A38(IOT_76)
MXR_ENBL: U16.B22(IOR_61_GBIN2) ; port MXR_ENBL
MXR_FM: U16.A32(IOR_66) ; port MXR_FM
PMOD_IO1: J6.1 U16.B24(IOR_65)
PMOD_IO2: J6.3 U16.A31(IOR_64)
PMOD_IO3: J6.5 U16.B23(IOR_63)
PMOD_IO4: J6.7 U16.B21(IOR_57)
PMOD_IO5: J6.2 U16.A25(IOR_53)
PMOD_IO6: J6.4 U16.A26(IOR_55)
PMOD_IO7: J6.6 U16.A27(IOR_58)
PMOD_IO8: J6.8 U16.B20(IOR_56)
RF_TR_VC1: TP21.1(TP) U16.A34(IOR_69) ; port TR_VC1
RF_TR_VC2: TP22.1(TP) U16.B26(IOR_70) ; port TR_VC2
RPI_MISO: U16.B17(IOB_44_SDO) ; port ICE_FP_MISO
RPI_MOSI: U16.A22(IOB_45_SDI) ; port ICE_FP_MOSI
RXMODE: TP24.1(TP) U16.B27(IOR_72) ; port TR_VC1_B
SHDN_RX_LNA: U16.A46(IOT_90) ; port SHDN_RX_LNA
SHDN_TX_LNA: U16.B36(IOT_93) ; port SHDN_TX_LNA
SMI_READ_REQ: U16.B19(IOR_52) ; port SMI_READ_REQ
SMI_SA1: U16.A43(IOT_84_GBIN1) ; port SMI_SA1  [project net GP4_SA1]
SMI_SA2: U16.A48(IOT_95) ; port SMI_SA2
SMI_SA3: U16.A47(IOT_92) ; port SMI_SA3
SMI_SD0: U16.A16(IOB_34) ; port SMI_SD0  [project net GP8_SD0]
SMI_SD1: U16.B11(IOB_33) ; port SMI_SD1  [project net GP9_SD1]
SMI_SD2: U16.B10(IOB_32) ; port SMI_SD2  [project net GP10_SD2]
SMI_SD3: U16.B12(IOB_36_GBIN4) ; port SMI_SD3  [project net GP11_SD3]
SMI_SD4: U16.B14(IOB_40) ; port SMI_SD4  [project net GP12_SD4]
SMI_SD5: U16.A20(IOB_43_CBSEL1) ; port SMI_SD5  [project net GP13_SD5]
SMI_SD6: U16.A13(IOB_30) ; port SMI_SD6  [project net GP14_SD6]
SMI_SD7: U16.A14(IOB_35_GBIN5) ; port SMI_SD7  [project net GP15_SD7]
SMI_SOE_SE: U16.B15(IOB_42_CBSEL0) ; port SMI_SOE_SE  [project net GP6_SOE_SE]
SMI_SWE_SRW: U16.B13(IOB_38) ; port SMI_SWE_SRW  [project net GP7_SWE_SRW]
SMI_WRITE_REQ: U16.A19(IOB_41) ; port SMI_WRITE_REQ
USR_SW: U16.B31(IOT_81) ; port USR_SW
NetC70_2: C70.2 C71.2 L18.1 U25.1(EN) U25.4(VCC)
NetD11_A: D11.A R51.2
NetD12_A: D12.A R52.2
NetU16_A29: U16.A29(IOR_60_GBIN3) U25.3(OUT)

Not connected (* = marked no-connect by the designer): U16 A1(IOL_1B)* A8(IOL_6B_GBIN7)* A9(IOL_7A_GBIN6)* A11(IOL_10B)* A37(VPP_FAST)* A45(IOT_88)* B5(IOL_6A)* B7(IOL_7B)* B9(IOL_11B)* B32(IOT_85_GBIN0)* B35(IOT_91)*

### Layout directives
differential pair: FP_TX_CLK_N, FP_TX_CLK_P, FP_TX_N, FP_TX_P
net class LVDS: AT86_RX09_N, AT86_RX09_P, AT86_RX24_N, AT86_RX24_P, AT86_RX_CLK_N, AT86_RX_CLK_P, AT86_TX_CLK_N, AT86_TX_CLK_P, AT86_TX_N, AT86_TX_P, FP_TX_CLK_N, FP_TX_CLK_P, FP_TX_N, FP_TX_P
net class SMI: GP4_SA1, GP6_SOE_SE, GP7_SWE_SRW, GP8_SD0, GP9_SD1, GP10_SD2, GP11_SD3, GP12_SD4, GP13_SD5, GP14_SD6, GP15_SD7, SMI_READ_REQ, SMI_SA2, SMI_SA3, SMI_WRITE_REQ

### Notes on the sheet
- FPGA
- POWER TERMINALS
- PMOD
- LEDS
- Intentionally connected to groung for PCB GND flow
- LVDS Negated Pairs
  ==============
  AT86_TX
  AT86_RX09
  AT86_TX_CLK
  The other two are direct logic.
- PROGRAMMING
  ================
  POR=> Check SS
  1. if SS='1' => if NVCM programmed, use NVCM, otherwise use external flash (SPI MASTER).
  2. if SS='0', wait to be configured from external controller through SPI
  RESET - restarts the configuration
  CDONE - before configuration finished is '0', When done turns '1'
- Configuration Resistors - Place 0 Ohm for pulldowns as needed
  Apply internal FPGA pullups on all config pins
- This work is licensed under a Creative Commons
- Attribution-ShareAlike 4.0 International License.
- Calculation of differential lines
  ======================
  VCCIO = 2.5V
  VOD = 0.5V (this is the differential swing nominal)
  Rouput = 30 Ohms (given by ICE40 Specs)
  The parallel output resistor:
  VCCIO = 2.5V   =>    Rp = 2*(50*2.5/(2.5 - (2*0.5)))= 250 / 1.5 = 166 Ohms      => Rp/2 = 83.3 Ohms
  The series output resistors:
  VCCIO = 2.5V   =>    Rs = (50*83.3)/(83.3-50)-30 = 4165/33.5 -30 = 95 Ohms
  But, we want to make Rs a 100 Ohms to minimize BOM =>
  Rs = 100 => Rp = 162.5 Ohms => Vod = 0.48 Vdiff => Looks good enough!
  Connect the positive or true polarity side of the differential pair to the DPxxA input and the negative or complementary
  side of the pair to the DPxxB input.
  ==== If it is easier to route the differential pair, the input pins can be swapped, which produces an inverted input value. ====
  ====The inverted input value can subsequently be inverted by logic within the FPGA. ====
- DESIGNER:
- REVIEWER:
- TITLE
- PRODUCT NAME / P/N
- SIZE
- DATE:
- DRAWING NO.
- REV:
- SHT
- OF
- www.cariboulabs.co
- A3
- Open Source RF Tools
- (in symbol ICE40LP1K-QN84) BANK0 (TOP); BANK1 (RIGHT); BANK2 (BOTTOM); BANK3 (LEFT / LVDS)

### Library data of the parts
C66 C121 = Capacitor: as C1 on sheet AT86RF; Vmax: 10V; Technology: X5R; VALUE: 4.7u
C67 = Capacitor: as C32 on sheet AT86RF; Vmax: 25V; Technology: C0G; VALUE: 10n
C68 C69 C71-C74 C119 C120 = Capacitor: as C5 on sheet AT86RF; Tolerance: 10%; Vmax: 16V; Technology: X5R; VALUE: 100n
C70 = Capacitor: as C13 on sheet AT86RF; Tolerance: 5%; Vmax: 100V; Technology: C0G; VALUE: 1n
C80 = Capacitor: Multilayer Ceramic Capacitors MLCC - SMD/SMT 0402 MLCC X5R 4.7 uF +/ -20% 10V; Tolerance: 20%; Temp. Range: [-55, 85]; SRF: TBD [GHz]; Initial Voltage: 0; Vmax: 10V; Manu. P/N: DNP; Technology: X5R; VALUE: DNP
D11 D12 = LTST-C190KRKT: as D7 on sheet AT86RF; Manu. P/N: LTST-C190KRKT
J6 = 10129383-912001ALF: Headers & Wire Housings ECONOSTIK HEADER DR VT SMT 2X6; Height: 8.58mm; Manu. P/N: 10129383-912001ALF
L18 = BLM15: as L1 on sheet AT86RF; Impedance @ 100 MHz: 1800 Ohms; Manu. P/N: BLM15HD182SN1D
R13 R17-R20 R22 R24 = Resistor: Thick Film Resistors - SMD 1/16watt 100ohms 1%; Manu. P/N: CRCW0402100RFKEDC; Power Rating: 62.5 mW (1/16 W); Temp. Ceoff.: 100 PPM / C; Tolerance: 1%; VALUE: 100
R14 R15 R27 R28 = Resistor: as R3 on sheet Top; Tolerance: 1%; VALUE: 10k
R21 R23 = Resistor: Thick Film Resistors - SMD 1/16watt 162ohms 1%; Manu. P/N: CRCW0402162RFKED; Power Rating: 62.5 mW (1/16 W); Temp. Ceoff.: 100 PPM / C; Tolerance: 1%; VALUE: 162
R38-R41 = Resistor: Manu. P/N: CRCW04020000Z0EDC; Power Rating: 62.5 mW (1/16 W); Temp. Ceoff.: 100 PPM / C; Tolerance: 1%; Value: 0 Ohms
R51 R52 = Resistor: as R1 on sheet AT86RF; Tolerance: 1%; VALUE: 470
TP20-TP24 = TEST_POINT
U16 = ICE40LP1K-QN84: FPGA - Field Programmable Gate Array iCE40LP 1280 LUTs 1.2V Ultra Low-Power; Manu. P/N: ICE40LP1K-QN84
U25 = SG-8018CG 125.0000M-TJHPA3: Standard Clock Oscillators SG-8018CG 125.0000M-TJHPA3: MHZ OSC 1.8V 3.3V +/-50PPM -40 105C O/E 250TR; Alt2: ECS-2520MVQ-1250-BN-TR; Alt1: SG-8018CG 125.0000M-TJHPA3

## Sheet RFFE.SchDoc
size A3; DocumentNumber: 5; Revision: B; SheetNumber: 5; SheetTotal: 7; SheetTitle: RF Front-End; Designer: DM; Reviewer: -
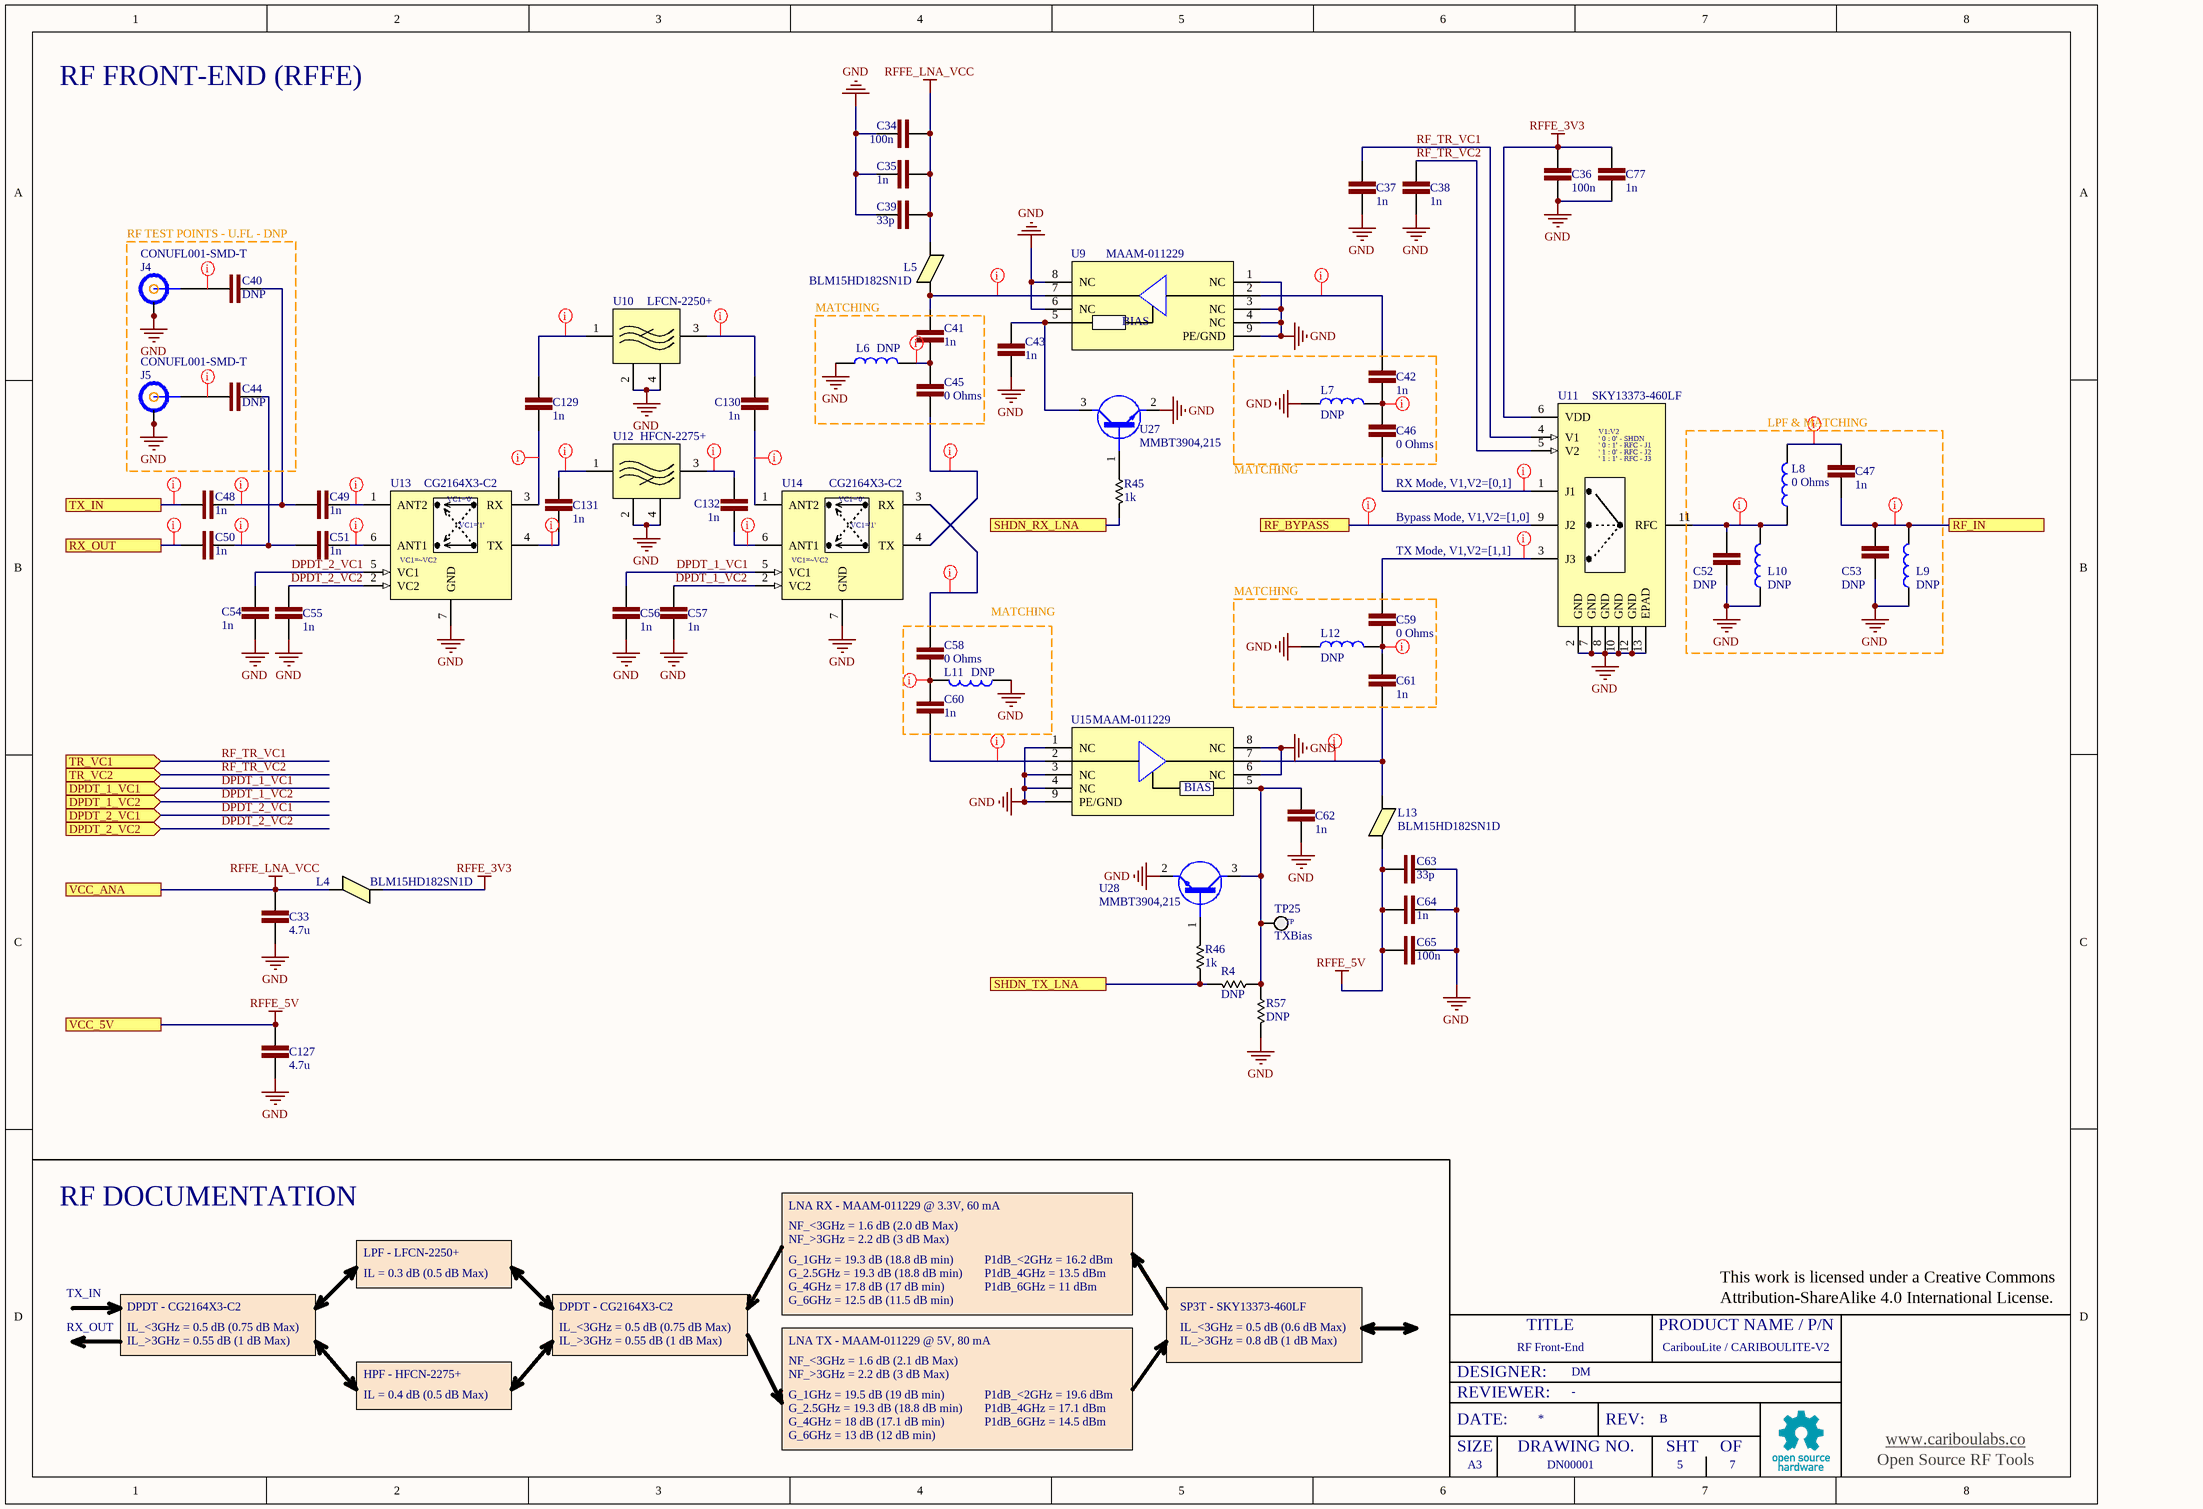
[diagram p3: RFFE.SchDoc]

### Parts
C33  4.7u  [MURATA 0402]
C34  100n  [MURATA 0402]
C35  1n  [MURATA 0402]
C36  100n  [MURATA 0402]
C37  1n  [MURATA 0402]
C38  1n  [MURATA 0402]
C39  33p  [MURATA 0402]
C40  DNP  [MURATA 0402]
C41  1n  [MURATA 0402]
C42  1n  [MURATA 0402]
C43  1n  [MURATA 0402]
C44  DNP  [MURATA 0402]
C45  0 Ohms  [MURATA 0402]
C46  0 Ohms  [MURATA 0402]
C47  1n  [MURATA 0402]
C48  1n  [MURATA 0402]
C49  1n  [MURATA 0402]
C50  1n  [MURATA 0402]
C51  1n  [MURATA 0402]
C52  DNP  [MURATA 0402]
C53  DNP  [MURATA 0402]
C54  1n  [MURATA 0402]
C55  1n  [MURATA 0402]
C56  1n  [MURATA 0402]
C57  1n  [MURATA 0402]
C58  0 Ohms  [MURATA 0402]
C59  0 Ohms  [MURATA 0402]
C60  1n  [MURATA 0402]
C61  1n  [MURATA 0402]
C62  1n  [MURATA 0402]
C63  33p  [MURATA 0402]
C64  1n  [MURATA 0402]
C65  100n  [MURATA 0402]
C77  1n  [MURATA 0402]
C127  4.7u  [MURATA 0402]
C129  1n  [MURATA 0402]
C130  1n  [MURATA 0402]
C131  1n  [MURATA 0402]
C132  1n  [MURATA 0402]
J4  CONUFL001-SMD-T  [LINX_CONUFL001-SMD-T]
J5  CONUFL001-SMD-T  [LINX_CONUFL001-SMD-T]
L4  BLM15HD182SN1D  [0402 FERRITE BEAD]
L5  BLM15HD182SN1D  [0402 FERRITE BEAD]
L6  DNP  [CoilCraft 0402]
L7  DNP  [CoilCraft 0402]
L8  0 Ohms  [CoilCraft 0402]
L9  DNP  [CoilCraft 0402]
L10  DNP  [CoilCraft 0402]
L11  DNP  [CoilCraft 0402]
L12  DNP  [CoilCraft 0402]
L13  BLM15HD182SN1D  [0402 FERRITE BEAD]
R4  DNP  [PANASONIC 0402]
R45  1k  [PANASONIC 0402]
R46  1k  [PANASONIC 0402]
R57  DNP  [PANASONIC 0402]
TP25  TXBias  [TP_40]
U9  MAAM-011229  [PDFN_2MM_8LEAD]
U10  LFCN-2250+  [FV1206]
U11  SKY13373-460LF  [QFN50P200X200X60-13N-D]
U12  HFCN-2275+  [FV1206]
U13  CG2164X3-C2  [SON50P150X150X40-7N]
U14  CG2164X3-C2  [SON50P150X150X40-7N]
U15  MAAM-011229  [PDFN_2MM_8LEAD]
U27  MMBT3904,215  [SOT95P240X111-3N]
U28  MMBT3904,215  [SOT95P240X111-3N]

### Blocks framed on the sheet
RF TEST POINTS - U.FL - DNP: C40 C44 J4 J5
MATCHING: C41 C45 L6
LPF & MATCHING: C47 C52 C53 L8-L10
MATCHING: C59 C61 L12
MATCHING: C58 C60 L11

### Ports
DPDT_1_VC1 (in), DPDT_1_VC2 (in), DPDT_2_VC1 (in), DPDT_2_VC2 (in), RF_BYPASS, RF_IN, RX_OUT, SHDN_RX_LNA, SHDN_TX_LNA, TR_VC1 (in), TR_VC2 (in), TX_IN, VCC_5V, VCC_ANA

### Nets
GND: C33.2 C34.1 C35.1 C36.1 C37.2 C38.2 C39.1 C43.1 C52.1 C53.1 C54.1 C55.1 C56.1 C57.1 C62.1 C63.2 C64.1 C65.1 C77.1 C127.1 J4.2(OUTER) J4.3(OUTER) J5.2(OUTER) J5.3(OUTER) L6.1 L7.1 L9.1 L10.1 L11.1 L12.1 R57.1 U9.1(NC) U9.3(NC) U9.4(NC) U9.6(NC) U9.8(NC) U9.9(PE/GND) U10.2 U10.4 U11.2(GND) U11.7(GND) U11.8(GND) U11.10(GND) U11.12(GND) U11.13(EPAD) U12.2 U12.4 U13.7(GND) U14.7(GND) U15.1(NC) U15.3(NC) U15.4(NC) U15.6(NC) U15.8(NC) U15.9(PE/GND) U27.2(E) U28.2(E)
RFFE_3V3: C36.2 C77.2 L4.2 U11.6(VDD)
RFFE_5V: C63.1 C64.2 C65.2 C127.2 L13.1 ; port VCC_5V
RFFE_LNA_VCC: C33.1 C34.2 C35.2 C39.2 L4.1 L5.1 ; port VCC_ANA
DPDT_1_VC1: C54.2 C56.2 U13.5(VC1) U14.5(VC1) ; port DPDT_1_VC1, port DPDT_2_VC1  [also labelled DPDT_2_VC1]
DPDT_1_VC2: C55.2 C57.2 U13.2(VC2) U14.2(VC2) ; port DPDT_1_VC2, port DPDT_2_VC2  [also labelled DPDT_2_VC2]
RF_TR_VC1: C37.1 U11.4(V1) ; port TR_VC1
RF_TR_VC2: C38.1 U11.5(V2) ; port TR_VC2
SHDN_RX_LNA: R45.2 ; port SHDN_RX_LNA
SHDN_TX_LNA: R4.1 R46.2 ; port SHDN_TX_LNA
NetC40_1: C40.1 C48.1 C49.2
NetC40_2: C40.2 J4.1(INNER)
NetC41_1: C41.1 C45.2 L6.2
NetC41_2: C41.2 L5.2 U9.7
NetC42_1: C42.1 C46.2 L7.2
NetC42_2: C42.2 U9.2
NetC43_2: C43.2 U9.5 U27.3(C)
NetC44_1: C44.1 C50.1 C51.2
NetC44_2: C44.2 J5.1(INNER)
NetC45_1: C45.1 U14.4(TX)
NetC46_1: C46.1 U11.1(J1)
NetC47_1: C47.1 L8.2
NetC47_2: C47.2 C53.2 L9.2 ; port RF_IN
NetC48_2: C48.2 ; port TX_IN
NetC49_1: C49.1 U13.1(ANT2)
NetC50_2: C50.2 ; port RX_OUT
NetC51_1: C51.1 U13.6(ANT1)
NetC52_2: C52.2 L8.1 L10.2 U11.11(RFC)
NetC58_1: C58.1 C60.2 L11.2
NetC58_2: C58.2 U14.3(RX)
NetC59_1: C59.1 C61.2 L12.2
NetC59_2: C59.2 U11.3(J3)
NetC60_1: C60.1 U15.2
NetC61_1: C61.1 L13.2 U15.7
NetC62_2: C62.2 R4.2 R57.2 TP25.1(TP) U15.5 U28.3(C)
NetC84_2: U11.9(J2) ; port RF_BYPASS
NetC129_1: C129.1 U10.1
NetC129_2: C129.2 U13.3(RX)
NetC130_1: C130.1 U10.3
NetC130_2: C130.2 U14.1(ANT2)
NetC131_1: C131.1 U12.1
NetC131_2: C131.2 U13.4(TX)
NetC132_1: C132.1 U12.3
NetC132_2: C132.2 U14.6(ANT1)
NetR45_1: R45.1 U27.1(B)
NetR46_1: R46.1 U28.1(B)

### Layout directives
net class RF50OHM: NetC40_1, NetC40_2, NetC41_1, NetC41_2, NetC42_1, NetC42_2, NetC44_1, NetC44_2, NetC45_1, NetC46_1, NetC47_1, NetC47_2, NetC48_2, NetC49_1, NetC50_2, NetC51_1, NetC52_2, NetC58_1, NetC58_2, NetC59_1, NetC59_2, NetC60_1, NetC61_1, NetC84_2, NetC129_1, NetC129_2, NetC130_1, NetC130_2, NetC131_1, NetC131_2, NetC132_1, NetC132_2

### Notes on the sheet
- RF FRONT-END (RFFE)
- MATCHING
- RX Mode, V1,V2=[0,1]
- (near U11) Bypass Mode, V1,V2=[1,0]
- TX Mode, V1,V2=[1,1]
- RF DOCUMENTATION
- LPF - LFCN-2250+
- LNA RX - MAAM-011229 @ 3.3V, 60 mA
- NF_>3GHz = 2.2 dB (3 dB Max)
- NF_<3GHz = 1.6 dB (2.0 dB Max)
- G_1GHz = 19.3 dB (18.8 dB min)
- P1dB_<2GHz = 16.2 dBm
- TX_IN
- DPDT - CG2164X3-C2
- IL = 0.3 dB (0.5 dB Max)
- G_2.5GHz = 19.3 dB (18.8 dB min)
- G_6GHz = 12.5 dB (11.5 dB min)
- G_4GHz = 17.8 dB (17 dB min)
- P1dB_4GHz = 13.5 dBm
- P1dB_6GHz = 11 dBm
- SP3T - SKY13373-460LF
- This work is licensed under a Creative Commons
- Attribution-ShareAlike 4.0 International License.
- RX_OUT
- IL_>3GHz = 0.55 dB (1 dB Max)
- IL_<3GHz = 0.5 dB (0.75 dB Max)
- HPF - HFCN-2275+
- IL = 0.4 dB (0.5 dB Max)
- LNA TX - MAAM-011229 @ 5V, 80 mA
- NF_<3GHz = 1.6 dB (2.1 dB Max)
- G_1GHz = 19.5 dB (19 dB min)
- P1dB_<2GHz = 19.6 dBm
- IL_>3GHz = 0.8 dB (1 dB Max)
- IL_<3GHz = 0.5 dB (0.6 dB Max)
- G_6GHz = 13 dB (12 dB min)
- G_4GHz = 18 dB (17.1 dB min)
- P1dB_4GHz = 17.1 dBm
- P1dB_6GHz = 14.5 dBm
- DESIGNER:
- REVIEWER:
- TITLE
- PRODUCT NAME / P/N
- SIZE
- DATE:
- DRAWING NO.
- REV:
- SHT
- OF
- www.cariboulabs.co
- A3
- Open Source RF Tools
- (in symbol CG2164X3-C2) VC1='0'; VC1='1'; VC1=~VC2
- (in symbol MAAM-011229) BIAS
- (in symbol SKY13373-460LF) V1:V2; ' 0 : 0' - SHDN; ' 0 : 1' - RFC - J1; ' 1 : 0' - RFC - J2; ' 1 : 1' - RFC - J3

### Library data of the parts
C33 C127 = Capacitor: as C1 on sheet AT86RF; Vmax: 10V; Technology: X5R; VALUE: 4.7u
C34 C36 C65 = Capacitor: as C5 on sheet AT86RF; Tolerance: 10%; Vmax: 16V; Technology: X5R; VALUE: 100n
C35 C37 C38 C40-C44 C47-C51 C54-C57 C60-C62 C64 C77 C129-C132 = Capacitor: as C13 on sheet AT86RF; Tolerance: 5%; Vmax: 100V; Technology: C0G
  C35 C37 C38 C41-C43 C47-C51 C54-C57 C60-C62 C64 C77 C129-C132: VALUE: 1n
  C40 C44: VALUE: DNP
C39 C63 = Capacitor: as C16 on sheet AT86RF; Tolerance: 5%; Vmax: 50V; Technology: C0G; VALUE: 33p
C45 C46 C58 C59 = Capacitor: 0 Ohms jumper resistor 0402; Tolerance: 5%; Vmax: 100V; Manu. P/N: CRCW04020000Z0EDC; Temp. Range: [-40, 125]; SRF: TBD [GHz]; Initial Voltage: 0; Technology: C0G; VALUE: 0 Ohms
C52 C53 = Capacitor: as C2 on sheet AT86RF; Manu. P/N: *; Technology: C0G; VALUE: DNP
J4 J5 = CONUFL001-SMD-T: RF Connectors / Coaxial Connectors U.FL Straight Surface Mount Jack; Manu. P/N: CONUFL001-SMD-T
L4 L5 L13 = BLM15: as L1 on sheet AT86RF; Impedance @ 100 MHz: 1800 Ohms; Manu. P/N: BLM15HD182SN1D
L6 L7 L9-L12 = Inductor: Tolerance: 5%; DC Imax: TBD [A]; DC Rmax: TBD [Ohm]; SRF: TBD [GHz]; Manu. P/N: *; VALUE: DNP
L8 = Inductor: 0 Ohms jumper resistor 0402; Tolerance: 5%; Manu. P/N: CRCW04020000Z0EDC; DC Imax: TBD [A]; DC Rmax: TBD [Ohm]; SRF: TBD [GHz]; VALUE: 0 Ohms
R4 R57 = Resistor: <1>; Power Rating: 62.5 mW (1/16 W); Temp. Ceoff.: 100 PPM/C; Tolerance: 1%; Manu. P/N: DNP; VALUE: DNP
R45 R46 = Resistor: Thick Film Resistors - SMD 0402 1/16watt 1Kohms 1%; Manu. P/N: CRCW04021K00FKEDC; Power Rating: 62.5 mW (1/16 W); Temp. Ceoff.: 100 PPM/C; Tolerance: 1%; VALUE: 1k
TP25 = TEST_POINT
U9 U15 = MAAM-011229: RF Amplifier .05-4GHz NF 2.2dBmax -40C +85C; Manu. P/N: MAAM-011229
U10 = LFCN-2250+: LTCC Low Pass Filter, DC - 2200 MHz, 50Ω; Manu. P/N: LFCN-2250+
U11 = SKY13373-460LF: RF Switch ICs .1-6.0GHz SP3T IL .45dB @ 2.5GHz; Manu. P/N: SKY13373-460LF
U12 = HFCN-2275+: Signal Conditioning HI PASS FLTR / SURF MT / RoHS; Manu. P/N: HFCN-2275+
U13 U14 = CG2164X3-C2: RF Switch ICs 2.5 and 6GHz DPDT 802.11a/b/g/n/ac; Manu. P/N: CG2164X3-C2
U27 U28 = MMBT3904,215: Bipolar Transistors - BJT TRANS BIPOLAR; Manu. P/N: MMBT3904,215

## Sheet DIG_INTERFACES.SchDoc
size A3; DocumentNumber: 3; Revision: B; SheetNumber: 3; SheetTotal: 7; SheetTitle: Connectors and Power; Designer: DM; Reviewer: -
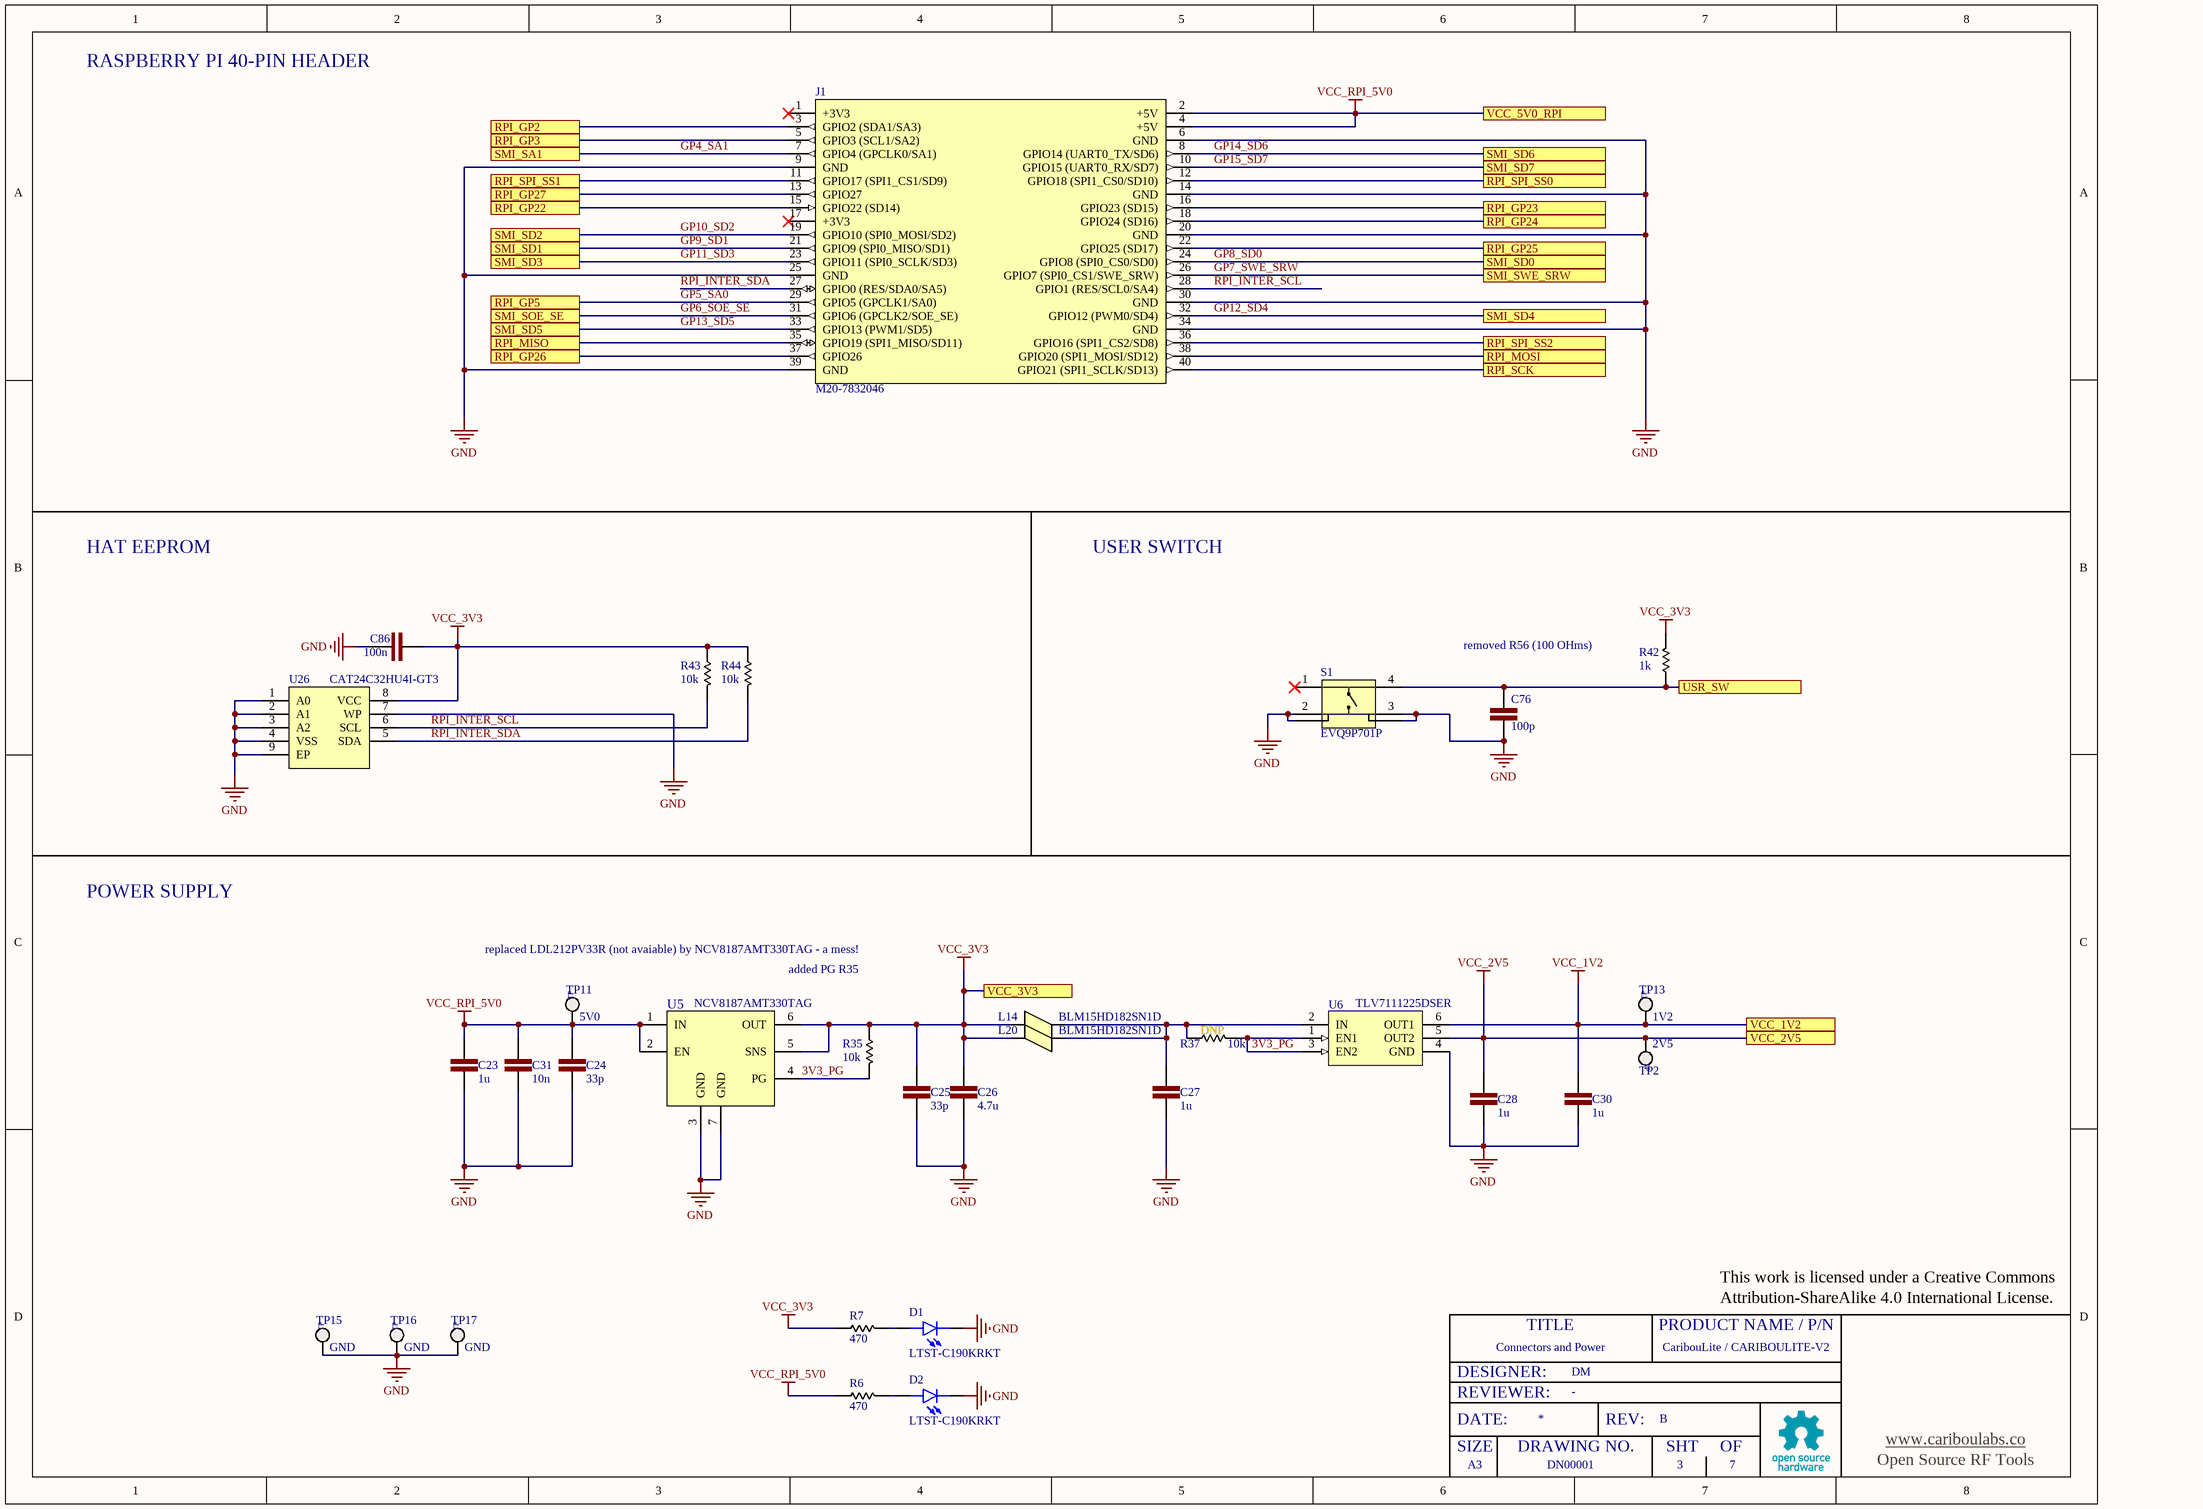
[diagram p4: DIG_INTERFACES.SchDoc]

### Parts
C23  1u  [MURATA 0402]
C24  33p  [MURATA 0402]
C25  33p  [MURATA 0402]
C26  4.7u  [MURATA 0402]
C27  1u  [MURATA 0402]
C28  1u  [MURATA 0402]
C30  1u  [MURATA 0402]
C31  10n  [MURATA 0402]
C76  100p  [MURATA 0402]
C86  100n  [MURATA 0402]
D1  LTST-C190KRKT  [LEDC1608X35N]
D2  LTST-C190KRKT  [LEDC1608X35N]
J1  M20-7832046  [rpi_zero]
L14  BLM15HD182SN1D  [0402 FERRITE BEAD]
L20  BLM15HD182SN1D  [0402 FERRITE BEAD]
R6  470  [PANASONIC 0402]
R7  470  [PANASONIC 0402]
R35  10k  [PANASONIC 0402]
R37  10k  [PANASONIC 0402]  (no BOM)
R42  1k  [PANASONIC 0402]
R43  10k  [PANASONIC 0402]
R44  10k  [PANASONIC 0402]
S1  EVQ9P701P  [EVQ9P701P]
TP2  2V5  [TP_40]
TP11  5V0  [TP_40]
TP13  1V2  [TP_40]
TP15  GND  [TP_40]
TP16  GND  [TP_40]
TP17  GND  [TP_40]
U5  NCV8187AMT330TAG  [SON65P200X200X80-7N]
U6  TLV7111225DSER  [SON50P150X150X80-6N]
U26  CAT24C32HU4I-GT3  [SON50P300X200X55-9N]

### Ports
RPI_GP2, RPI_GP3, RPI_GP5, RPI_GP22, RPI_GP23, RPI_GP24, RPI_GP25, RPI_GP26, RPI_GP27, RPI_MISO, RPI_MOSI, RPI_SCK, RPI_SPI_SS0, RPI_SPI_SS1, RPI_SPI_SS2, SMI_SA1, SMI_SD0, SMI_SD1, SMI_SD2, SMI_SD3, SMI_SD4, SMI_SD5, SMI_SD6, SMI_SD7, SMI_SOE_SE, SMI_SWE_SRW, USR_SW, VCC_1V2, VCC_2V5, VCC_3V3, VCC_5V0_RPI

### Nets
GND: C23.1 C24.2 C25.2 C26.1 C27.1 C28.1 C30.1 C31.2 C76.1 C86.1 D1.C D2.C J1.6(GND) J1.9(GND) J1.14(GND) J1.20(GND) J1.25(GND) J1.30(GND) J1.34(GND) J1.39(GND) S1.2 S1.3 S1.5 S1.6 TP15.1(TP) TP16.1(TP) TP17.1(TP) U5.3(GND) U5.7(GND) U6.4(GND) U26.1(A0) U26.2(A1) U26.3(A2) U26.4(VSS) U26.7(WP) U26.9(EP)
VCC_1V2: C30.2 TP13.1(TP) U6.6(OUT1) ; port VCC_1V2
VCC_2V5: C28.2 TP2.1(TP) U6.5(OUT2) ; port VCC_2V5
VCC_3V3: C25.1 C26.2 C86.2 L14.1 L20.1 R7.1 R35.1 R42.2 R43.1 R44.1 U5.5(SNS) U5.6(OUT) U26.8(VCC) ; port VCC_3V3  [project net RFFE_LNA_VCC]
VCC_RPI_5V0: C23.2 C24.1 C31.1 J1.2(+5V) J1.4(+5V) R6.1 TP11.1(TP) U5.1(IN) U5.2(EN) ; port VCC_5V0_RPI  [project net RFFE_5V]
3V3_PG: R35.2 R37.2 U5.4(PG) U6.1(EN1) U6.3(EN2)
AT86_IRQ: J1.15(GPIO22_(SD14)) ; port RPI_GP22
AT86_RESET: J1.16(GPIO23_(SD15)) ; port RPI_GP23
GP4_SA1: J1.7(GPIO4_(GPCLK0/SA1)) ; port SMI_SA1
GP5_SA0: J1.29(GPIO5_(GPCLK1/SA0)) ; port RPI_GP5
GP6_SOE_SE: J1.31(GPIO6_(GPCLK2/SOE_SE)) ; port SMI_SOE_SE
GP7_SWE_SRW: J1.26(GPIO7_(SPI0_CS1/SWE_SRW)) ; port SMI_SWE_SRW
GP8_SD0: J1.24(GPIO8_(SPI0_CS0/SD0)) ; port SMI_SD0
GP9_SD1: J1.21(GPIO9_(SPI0_MISO/SD1)) ; port SMI_SD1
GP10_SD2: J1.19(GPIO10_(SPI0_MOSI/SD2)) ; port SMI_SD2
GP11_SD3: J1.23(GPIO11_(SPI0_SCLK/SD3)) ; port SMI_SD3
GP12_SD4: J1.32(GPIO12_(PWM0/SD4)) ; port SMI_SD4
GP13_SD5: J1.33(GPIO13_(PWM1/SD5)) ; port SMI_SD5
GP14_SD6: J1.8(GPIO14_(UART0_TX/SD6)) ; port SMI_SD6
GP15_SD7: J1.10(GPIO15_(UART0_RX/SD7)) ; port SMI_SD7
ICE_CDONE: J1.13(GPIO27) ; port RPI_GP27
ICE_CRESET: J1.37(GPIO26) ; port RPI_GP26
ICE_FP_SCK: J1.40(GPIO21_(SPI1_SCLK/SD13)) ; port RPI_SCK
ICE_FP_SS_B: J1.12(GPIO18_(SPI1_CS0/SD10)) ; port RPI_SPI_SS0
RPI_INTER_SCL: J1.28(GPIO1_(RES/SCL0/SA4)) R43.2 U26.6(SCL)
RPI_INTER_SDA: J1.27(GPIO0_(RES/SDA0/SA5)) R44.2 U26.5(SDA)
RPI_MISO: J1.35(GPIO19_(SPI1_MISO/SD11)) ; port RPI_MISO
RPI_MOSI: J1.38(GPIO20_(SPI1_MOSI/SD12)) ; port RPI_MOSI
RPI_SS_AT86: J1.11(GPIO17_(SPI1_CS1/SD9)) ; port RPI_SPI_SS1
RPI_SS_MXR: J1.36(GPIO16_(SPI1_CS2/SD8)) ; port RPI_SPI_SS2
SMI_READ_REQ: J1.18(GPIO24_(SD16)) ; port RPI_GP24
SMI_SA2: J1.5(GPIO3_(SCL1/SA2)) ; port RPI_GP3
SMI_SA3: J1.3(GPIO2_(SDA1/SA3)) ; port RPI_GP2
SMI_WRITE_REQ: J1.22(GPIO25_(SD17)) ; port RPI_GP25
USR_SW: C76.2 R42.1 S1.4 ; port USR_SW
NetC27_2: C27.2 L14.2 L20.2 R37.1 U6.2(IN)
NetD1_A: D1.A R7.2
NetD2_A: D2.A R6.2

Not connected (* = marked no-connect by the designer): J1 1(+3V3)* 17(+3V3)*; S1 1*

### Notes on the sheet
- RASPBERRY PI 40-PIN HEADER
- HAT EEPROM
- USER SWITCH
- removed R56 (100 OHms)
- POWER SUPPLY
- replaced LDL212PV33R (not avaiable) by NCV8187AMT330TAG - a mess!
- added PG R35
- (near R37) DNP
- This work is licensed under a Creative Commons
- Attribution-ShareAlike 4.0 International License.
- DESIGNER:
- REVIEWER:
- TITLE
- PRODUCT NAME / P/N
- SIZE
- DATE:
- DRAWING NO.
- REV:
- SHT
- OF
- www.cariboulabs.co
- A3
- Open Source RF Tools

### Library data of the parts
C23 C27 C28 C30 = Capacitor: as C14 on sheet AT86RF; Technology: X5R; VALUE: 1u
C24 C25 = Capacitor: as C16 on sheet AT86RF; Tolerance: 5%; Vmax: 50V; Technology: C0G; VALUE: 33p
C26 = Capacitor: as C1 on sheet AT86RF; Vmax: 10V; Technology: X5R; VALUE: 4.7u
C31 = Capacitor: as C32 on sheet AT86RF; Vmax: 25V; Technology: C0G; VALUE: 10n
C76 = Capacitor: Multilayer Ceramic Capacitors MLCC - SMD/SMT 50V 100pF +/-0.05; Tolerance: 0.05pF; Manu. P/N: C0402C101J5GACTU; Temp. Range: [-55, 125]; SRF: TBD [GHz]; Initial Voltage: 0; Vmax: 50V; Technology: C0G; VALUE: 100p
C86 = Capacitor: as C5 on sheet AT86RF; Tolerance: 10%; Vmax: 16V; Technology: X5R; VALUE: 100n
D1 D2 = LTST-C190KRKT: as D7 on sheet AT86RF; Manu. P/N: LTST-C190KRKT
J1 = RaspberryPi: RPI 40-pin 2.54mm header, 2-rows, socket; Manu. P/N: M20-7832046, PPPC202LFBN-RC, 61304021821
L14 L20 = BLM15: as L1 on sheet AT86RF; Impedance @ 100 MHz: 1800 Ohms; Manu. P/N: BLM15HD182SN1D
R6 R7 = Resistor: as R1 on sheet AT86RF; Tolerance: 1%; VALUE: 470
R35 R37 R43 R44 = Resistor: as R3 on sheet Top; Tolerance: 1%; VALUE: 10k
R42 = Resistor: as R45 on sheet RFFE; Tolerance: 1%; VALUE: 1k
S1 = EVQ9P701P: Tactile Switches SMD 3.5X2.9MM SID-OP L SHAPED TERM 1.6N; Manu. P/N: EVQ9P701P
TP2 TP11 TP13 TP15-TP17 = TEST_POINT
U5 = NCV8187AMT330TAG: LDO Voltage Regulators 1.2A 3.3V Active discharge; Manu. P/N: NCV8187AMT330TAG
U6 = TLV7111225DSER: LDO Voltage Regulators Dual 200mA Output Lo Noise Hi PSRR LDO Rg; Manu. P/N: TLV7111225DSER
U26 = CAT24C32HU4I-GT3: EEPROM Serial-I2C 32K 4Kx8 1.8V/5V UDFN8 CAT24C32HU4I-GT3; Manu. P/N: CAT24C32HU4I-GT3